# EAGLE design FinalEffect (EAGLE 7.7.0)

## Sheet 1 of 6: Pots & analog mux
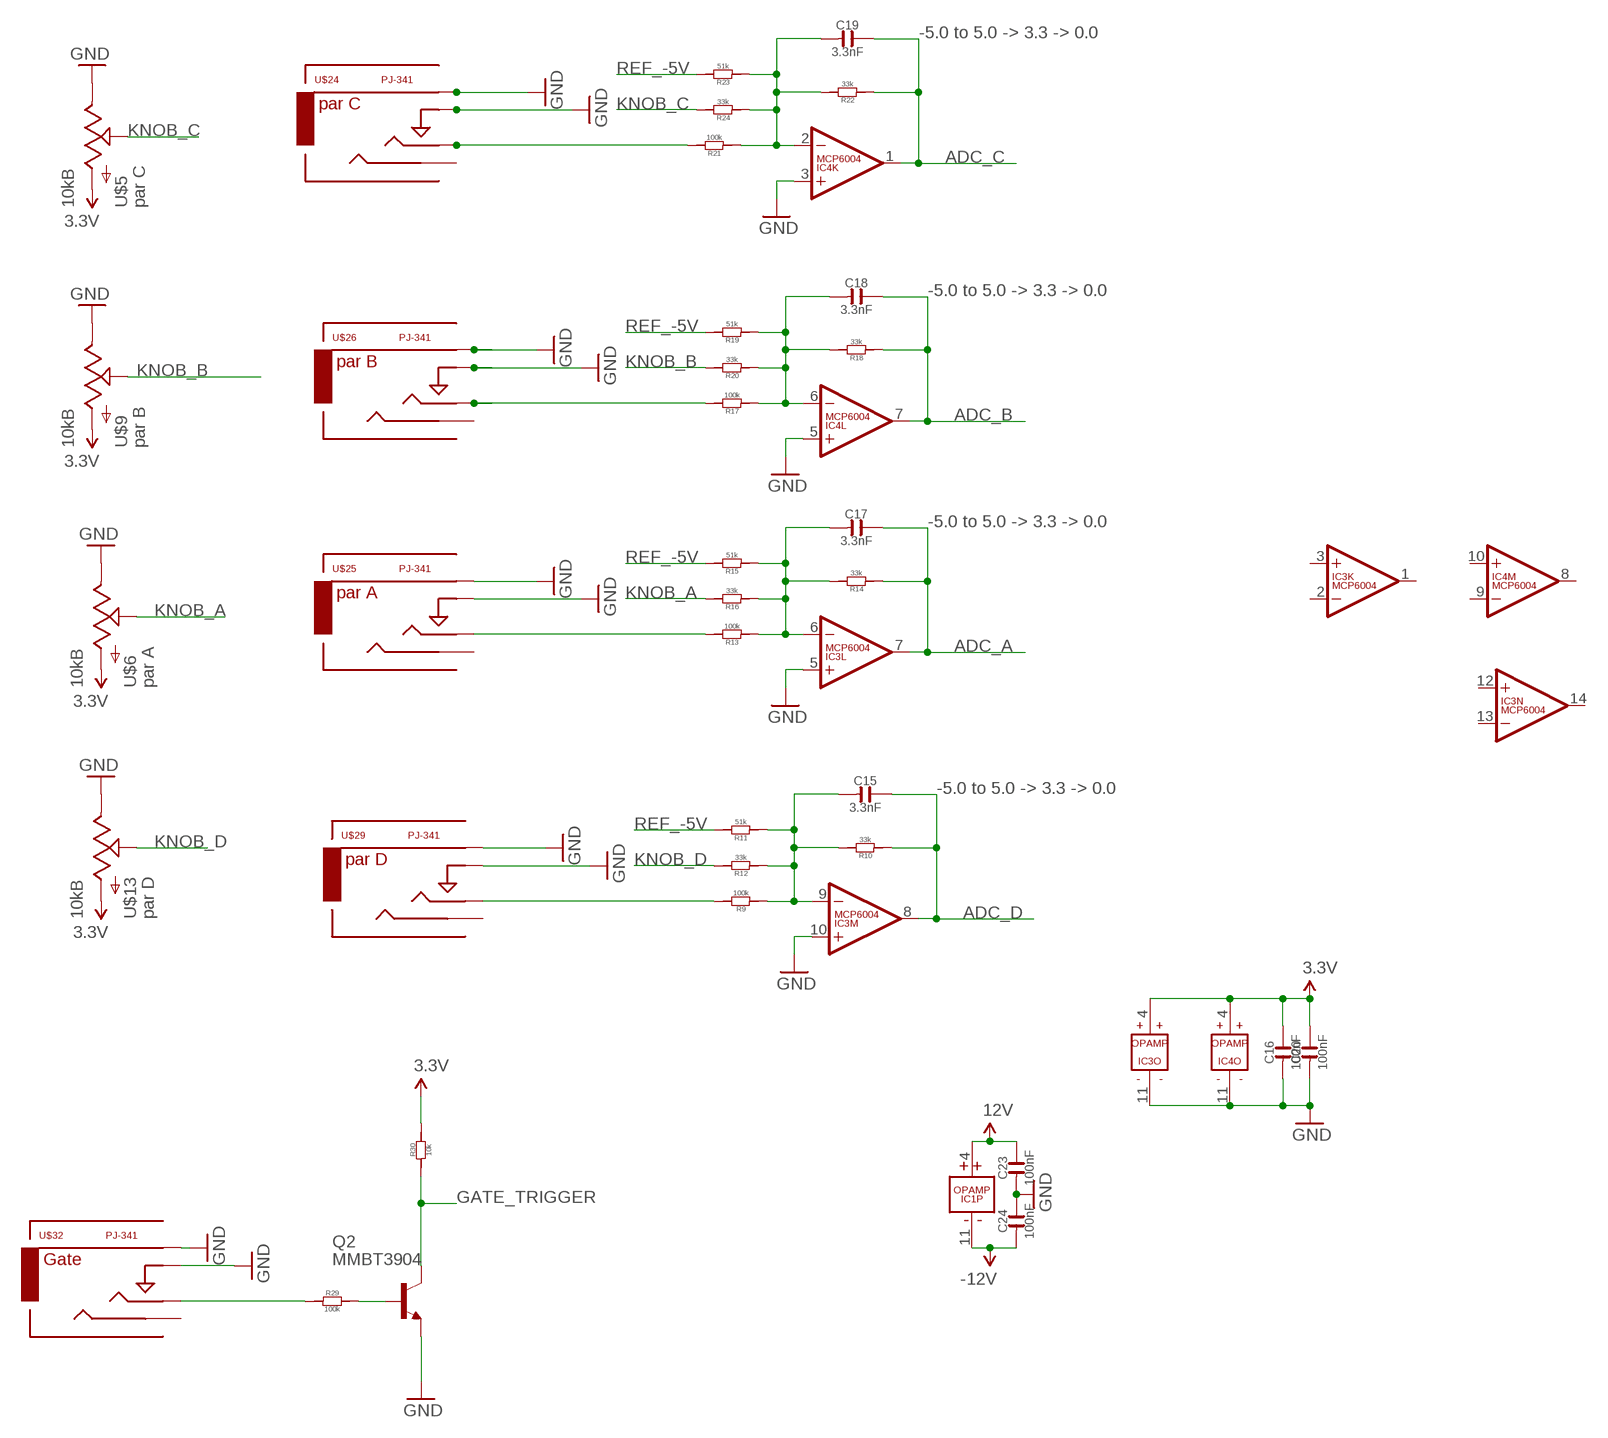
[diagram p0: schematic, sheet 1]

### Parts
C15  3.3nF  C-0603  [C0603]
C16  100nF  C-0603  [C0603]
C17  3.3nF  C-0603  [C0603]
C18  3.3nF  C-0603  [C0603]
C19  3.3nF  C-0603  [C0603]
C20  100nF  C-0603  [C0603]
C23  100nF  C-0603  [C0603]
C24  100nF  C-0603  [C0603]
IC1  TL074D  [SO14]
IC3  MCP6004  [SO14]
IC4  MCP6004  [SO14]
Q2  MMBT3904  MMBT3904LT1-NPN-SOT23-BEC  [SOT23-BEC]
R9  100k  R-0603  [R0603]
R10  33k  R-0603  [R0603]
R11  51k  R-0603  [R0603]
R12  33k  R-0603  [R0603]
R13  100k  R-0603  [R0603]
R14  33k  R-0603  [R0603]
R15  51k  R-0603  [R0603]
R16  33k  R-0603  [R0603]
R17  100k  R-0603  [R0603]
R18  33k  R-0603  [R0603]
R19  51k  R-0603  [R0603]
R20  33k  R-0603  [R0603]
R21  100k  R-0603  [R0603]
R22  33k  R-0603  [R0603]
R23  51k  R-0603  [R0603]
R24  33k  R-0603  [R0603]
R29  100k  R-0603  [R0603]
R30  10k  R-0603  [R0603]
U$5  10kB  POTZEPHPOT  [OG-POTS_ALPS_POT_VERTICAL]
U$6  10kB  POTZEPHPOT  [OG-POTS_ALPS_POT_VERTICAL]
U$9  10kB  POTZEPHPOT  [OG-POTS_ALPS_POT_VERTICAL]
U$13  10kB  POTZEPHPOT  [OG-POTS_ALPS_POT_VERTICAL]
U$24  PJ-341  AUDIO-JACKINPUT  [3.5MM-JACK-SWITCH-13MM-INPUT]
U$25  PJ-341  AUDIO-JACKINPUT  [3.5MM-JACK-SWITCH-13MM-INPUT]
U$26  PJ-341  AUDIO-JACKINPUT  [3.5MM-JACK-SWITCH-13MM-INPUT]
U$29  PJ-341  AUDIO-JACKINPUT  [3.5MM-JACK-SWITCH-13MM-INPUT]
U$32  PJ-341  AUDIO-JACKINPUT  [3.5MM-JACK-SWITCH-13MM-INPUT]

### Nets
3.3V [mediumpower]: C16.2 C20.2 IC3.4(O:V+) IC4.4(O:V+) R30.2 U$5.P$3(A) U$6.P$3(A) U$9.P$3(A) U$13.P$3(A) ; also sheet 2,3,5
12V [heavypower]: C23.2 IC1.4(P:V+) ; also sheet 3,5
-12V [heavypower]: C24.1 IC1.11(P:V-) ; also sheet 3,5
ADC_A: C17.2 IC3.7(L:OUT) R14.1 ; also sheet 2
ADC_B: C18.2 IC4.7(L:OUT) R18.1 ; also sheet 2
ADC_C: C19.2 IC4.1(K:OUT) R22.1 ; also sheet 2
ADC_D: C15.2 IC3.8(M:OUT) R10.1 ; also sheet 2
GATE_TRIGGER: Q2.C R30.1 ; also sheet 2
GND: C16.1 C20.1 C23.1 C24.2 IC3.5(L:+IN) IC3.10(M:+IN) IC3.11(O:V-) IC4.3(K:+IN) IC4.5(L:+IN) IC4.11(O:V-) Q2.E U$5.P$1(E) U$6.P$1(E) U$9.P$1(E) U$13.P$1(E) U$24.RING@3(RING) U$24.SWITCH@3(SWITCH) U$25.RING@3(RING) U$25.SWITCH@3(SWITCH) U$26.RING@3(RING) U$26.SWITCH@3(SWITCH) U$29.RING@3(RING) U$29.SWITCH@3(SWITCH) U$32.RING@3(RING) U$32.SWITCH@3(SWITCH) ; also sheet 2,3,5,6
KNOB_A: R16.2 U$6.P$2(S)
KNOB_B: R20.2 U$9.P$2(S)
KNOB_C: R24.2 U$5.P$2(S)
KNOB_D: R12.2 U$13.P$2(S)
N$3: R17.2 U$26.TIP@3(TIP)
N$4: C18.1 IC4.6(L:-IN) R17.1 R18.2 R19.1 R20.1
N$5: R21.2 U$24.TIP@3(TIP)
N$7: C19.1 IC4.2(K:-IN) R21.1 R22.2 R23.1 R24.1
N$11: Q2.B R29.2
N$15: R9.2 U$29.TIP@3(TIP)
N$16: C15.1 IC3.9(M:-IN) R9.1 R10.2 R11.1 R12.1
N$17: R13.2 U$25.TIP@3(TIP)
N$18: C17.1 IC3.6(L:-IN) R13.1 R14.2 R15.1 R16.1
N$19: R29.1 U$32.TIP@3(TIP)
REF_-5V: R11.2 R15.2 R19.2 R23.2 ; also sheet 3,5
Unconnected: IC3.1(K:OUT) IC3.2(K:-IN) IC3.3(K:+IN) IC3.12(N:+IN) IC3.13(N:-IN) IC3.14(N:OUT) IC4.8(M:OUT) IC4.9(M:-IN) IC4.10(M:+IN) U$24.SECOND@3(SECOND) U$25.SECOND@3(SECOND) U$26.SECOND@3(SECOND) U$29.SECOND@3(SECOND) U$32.SECOND@3(SECOND)

### Notes on the sheet
- -5.0 to 5.0 -> 3.3 -> 0.0
- -5.0 to 5.0 -> 3.3 -> 0.0
- -5.0 to 5.0 -> 3.3 -> 0.0
- -5.0 to 5.0 -> 3.3 -> 0.0

## Sheet 2 of 6: MCU
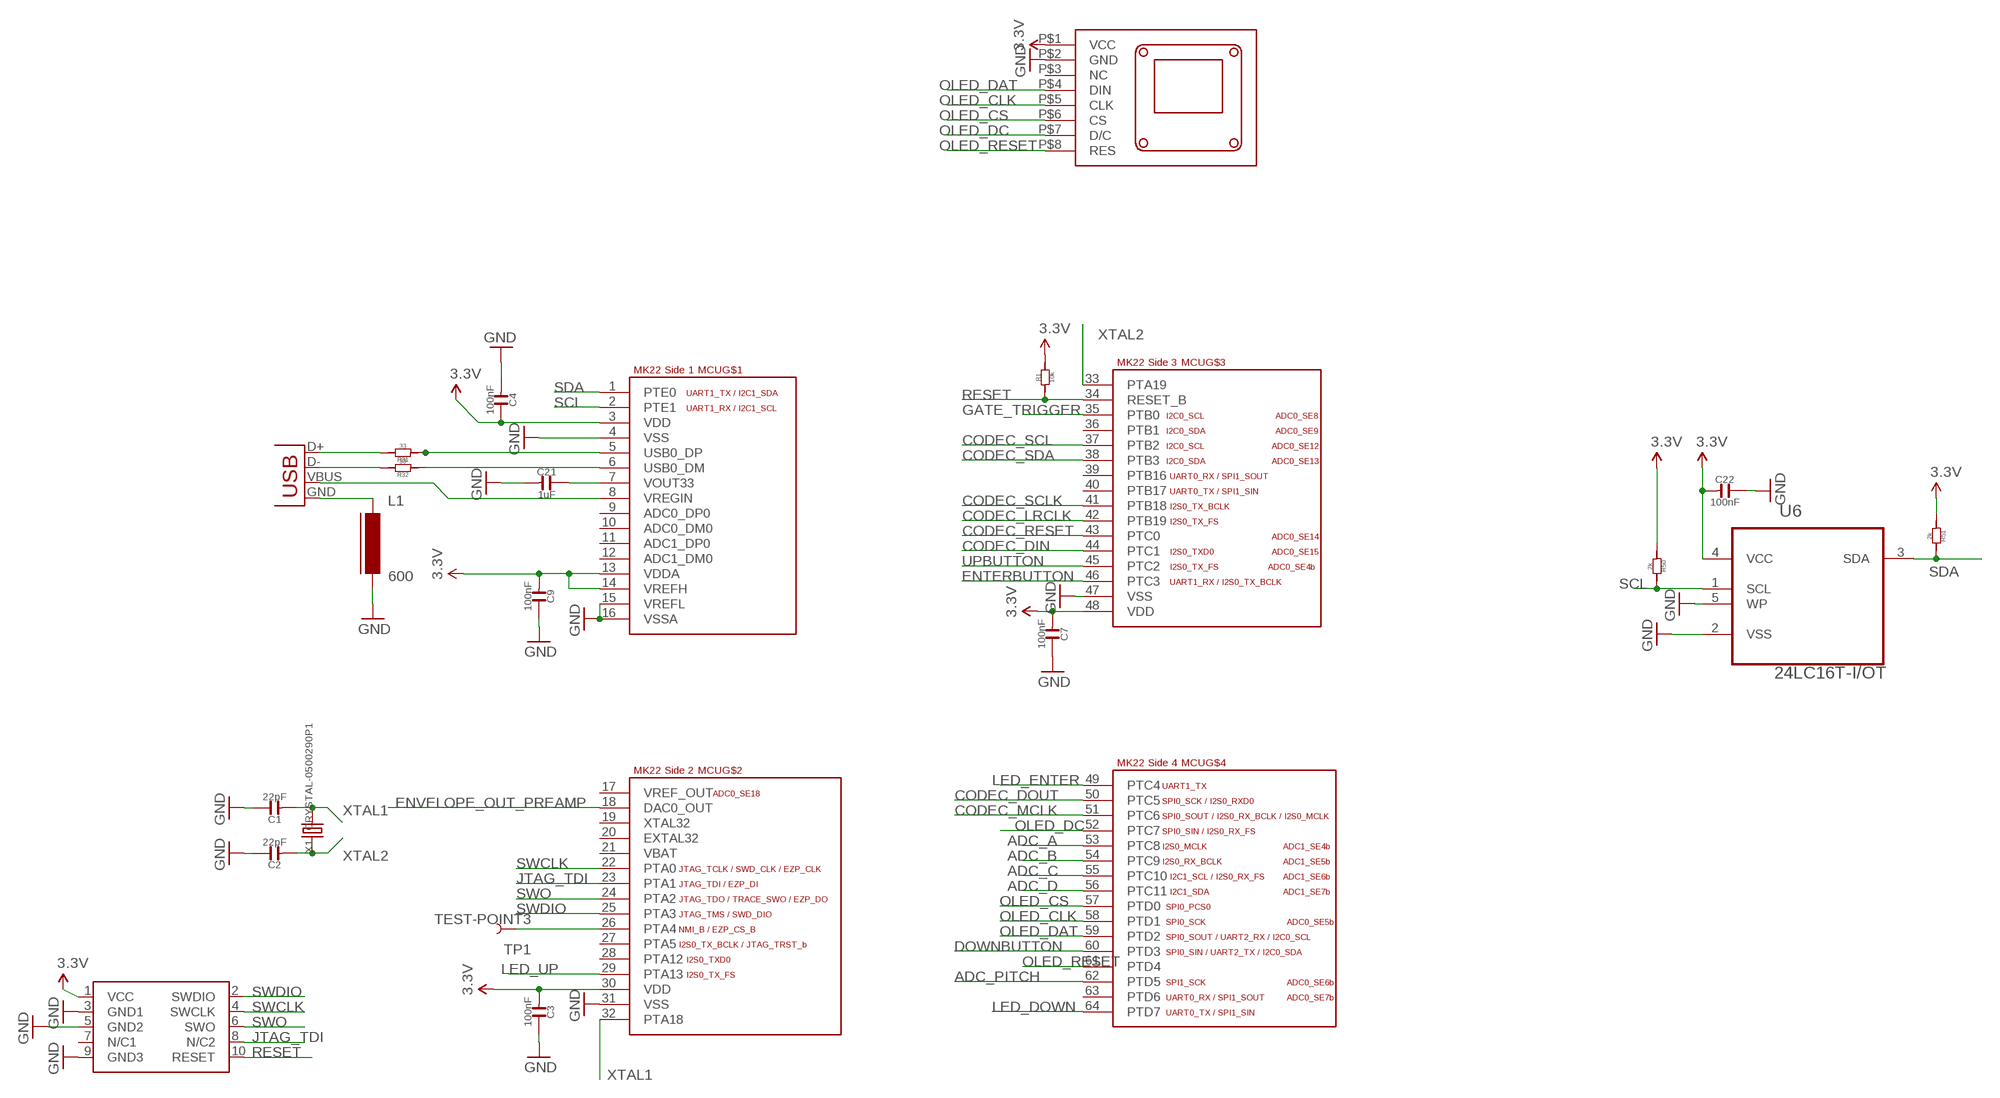
[diagram p1: schematic, sheet 2]

### Parts
C1  22pF  C-0603  [C0603]
C2  22pF  C-0603  [C0603]
C3  100nF  C-0603  [C0603]
C4  100nF  C-0603  [C0603]
C7  100nF  C-0603  [C0603]
C9  100nF  C-0603  [C0603]
C21  1uF  C-0603  [C0603]
C22  100nF  C-0603  [C0603]
JP1  USBPTH-VERTICAL  [USB-B-PTH-VERTICAL]
L1  600  FERRITE-0603  [FB603]
MCU  MK22_120_TQFP64  [MK22_TQFP64]
R1  10k  R-0603  [R0603]
R31  33  R-0603  [R0603]
R32  33  R-0603  [R0603]
R50  2k  R-0603  [R0603]
R51  2k  R-0603  [R0603]
SWD1  CORTEX_SWD  [M50-3600542]
TP1  TEST-POINT3  [PAD.03X.03]
U6  24LC16T-I/OT  24LC00T-I/OT  [SOT95P290X145-5N]
U$3  0.96OLEDMODULE  [1.3"OLEDMODULE]
X1  CRYSTAL-0500290P1  [2P-SMD-5.0X3.2]

### Nets
3.3V [mediumpower]: C3.1 C4.2 C7.1 C9.1 C22.1 MCU.3(VDD) MCU.13(VDDA) MCU.14(VREFH) MCU.30(VDD) MCU.48(VDD) R1.2 R50.1 R51.1 SWD1.1(VCC) U6.4(VCC) U$3.P$1(VCC) ; also sheet 1,3,5
ADC_A: MCU.53(PTC8) ; also sheet 1
ADC_B: MCU.54(PTC9) ; also sheet 1
ADC_C: MCU.55(PTC10) ; also sheet 1
ADC_D: MCU.56(PTC11) ; also sheet 1
ADC_PITCH: MCU.62(PTD5) ; also sheet 5
CODEC_DIN: MCU.44(PTC1) ; also sheet 5
CODEC_DOUT: MCU.50(PTC5) ; also sheet 5
CODEC_LRCLK: MCU.42(PTB19) ; also sheet 5
CODEC_MCLK: MCU.51(PTC6) ; also sheet 5
CODEC_RESET: MCU.43(PTC0) ; also sheet 5
CODEC_SCL: MCU.37(PTB2) ; also sheet 5
CODEC_SCLK: MCU.41(PTB18) ; also sheet 5
CODEC_SDA: MCU.38(PTB3) ; also sheet 5
DOWNBUTTON: MCU.60(PTD3) ; also sheet 6
ENTERBUTTON: MCU.46(PTC3) ; also sheet 6
ENVELOPE_OUT_PREAMP: MCU.18(DAC0_OUT) ; also sheet 5
GATE_TRIGGER: MCU.35(PTB0) ; also sheet 1
GND: C1.2 C2.2 C3.2 C4.1 C7.2 C9.2 C21.1 C22.2 L1.2 MCU.4(VSS) MCU.15(VREFL) MCU.16(VSSA) MCU.31(VSS) MCU.47(VSS) SWD1.3(GND1) SWD1.5(GND2) SWD1.9(GND3) U6.2(VSS) U6.5(WP) U$3.P$2(GND) ; also sheet 1,3,5,6
JTAG_TDI: MCU.23(PTA1) SWD1.8(N/C2)
LED_DOWN: MCU.64(PTD7) ; also sheet 6
LED_ENTER: MCU.49(PTC4) ; also sheet 6
LED_UP: MCU.29(PTA13) ; also sheet 6
N$20: C21.2 MCU.7(VOUT33)
N$21: JP1.D+ R31.2
N$22: JP1.D- R32.2
N$23 [mediumpower]: JP1.VBUS MCU.8(VREGIN)
N$24: MCU.5(USB0_DP) R31.1
N$25: MCU.6(USB0_DM) R32.1
N$26 [heavypower]: JP1.GND L1.1
N$57: MCU.26(PTA4) TP1.P$1
OLED_CLK: MCU.58(PTD1) U$3.P$5(CLK)
OLED_CS: MCU.57(PTD0) U$3.P$6(CS)
OLED_DAT: MCU.59(PTD2) U$3.P$4(DIN)
OLED_DC: MCU.52(PTC7) U$3.P$7(D/C)
OLED_RESET: MCU.61(PTD4) U$3.P$8(RES)
RESET: MCU.34(RESET_B) R1.1 SWD1.10(RESET)
SCL: MCU.2(PTE1) R50.2 U6.1(SCL)
SDA: MCU.1(PTE0) R51.2 U6.3(SDA)
SWCLK: MCU.22(PTA0) SWD1.4(SWCLK)
SWDIO: MCU.25(PTA3) SWD1.2(SWDIO)
SWO: MCU.24(PTA2) SWD1.6(SWO)
UPBUTTON: MCU.45(PTC2) ; also sheet 6
XTAL1: C1.1 MCU.32(PTA18) X1.2
XTAL2: C2.1 MCU.33(PTA19) X1.1
Unconnected: MCU.9(ADC0_DP0) MCU.10(ADC0_DM0) MCU.11(ADC1_DP0) MCU.12(ADC1_DM0) MCU.17(VREF_OUT) MCU.19(XTAL32) MCU.20(EXTAL32) MCU.21(VBAT) MCU.27(PTA5) MCU.28(PTA12) MCU.36(PTB1) MCU.39(PTB16) MCU.40(PTB17) MCU.63(PTD6) SWD1.7(N/C1) U$3.P$3(NC)

## Sheet 3 of 6: Power
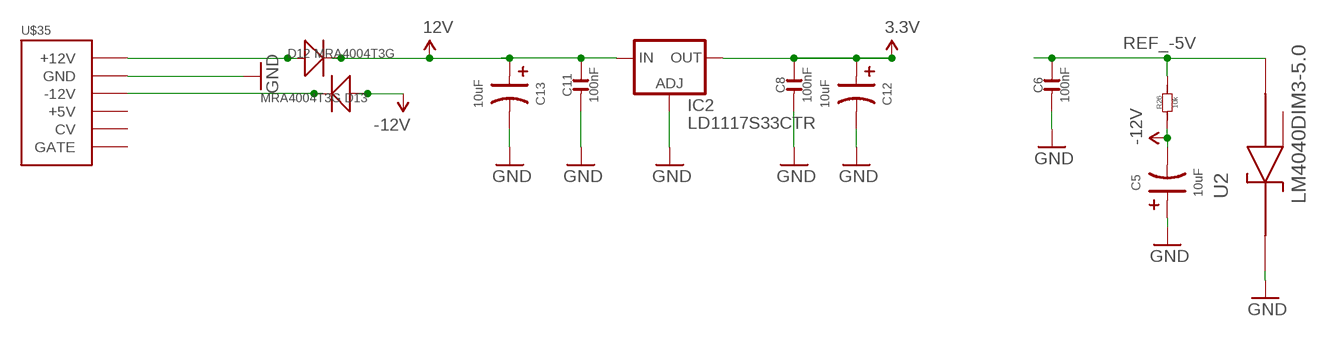
[diagram p2: schematic, sheet 3]

### Parts
C5  10uF  C-POLAR-A  [CASE-A_3216]
C6  100nF  C-0603  [C0603]
C8  100nF  C-0603  [C0603]
C11  100nF  C-0603  [C0603]
C12  10uF  C-POLAR-A  [CASE-A_3216]
C13  10uF  C-POLAR-A  [CASE-A_3216]
D12  MRA4004T3G  D-SMA  [DO-214AC]
D13  MRA4004T3G  D-SMA  [DO-214AC]
IC2  LD1117S33CTR  LD1117AS33TR  [SOT223]
R26  10k  R-0603  [R0603]
U2  LM4040DIM3-5.0  [SOT95P237X112-3N]
U$35  POWERSMT  [2X08_SMT_HEADER]

### Nets
3.3V [mediumpower]: C8.2 C12.+ IC2.2(OUT) IC2.4(OUT) ; also sheet 1,2,5
12V [heavypower]: C11.2 C13.+ D12.2(-) IC2.3(IN) ; also sheet 1,5
-12V [heavypower]: C5.- D13.1(+) R26.1 ; also sheet 1,5
GND: C5.+ C6.1 C8.1 C11.1 C12.- C13.- IC2.1(ADJ) U2.1(CATHODE) U$35.3(GND) U$35.4(GND) U$35.5(GND) U$35.6(GND) U$35.7(GND) U$35.8(GND) ; also sheet 1,2,5,6
N$13 [heavypower]: D12.1(+) U$35.9(+12V) U$35.10(+12V)
N$64 [heavypower]: D13.2(-) U$35.1(-12V) U$35.2(-12V)
REF_-5V: C6.2 R26.2 U2.2(ANODE) ; also sheet 1,5
Unconnected: U2.3(NC) U$35.11(+5V) U$35.12(+5V) U$35.13(CV) U$35.14(CV) U$35.15(GATE) U$35.16(GATE)

## Sheet 4 of 6: Cosmetic
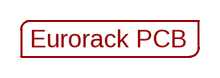
[diagram p3: schematic, sheet 4]

### Parts
U$1  EURORACK_PCB12HP  [EURORACK12HPPCB]

## Sheet 5 of 6: CODEC
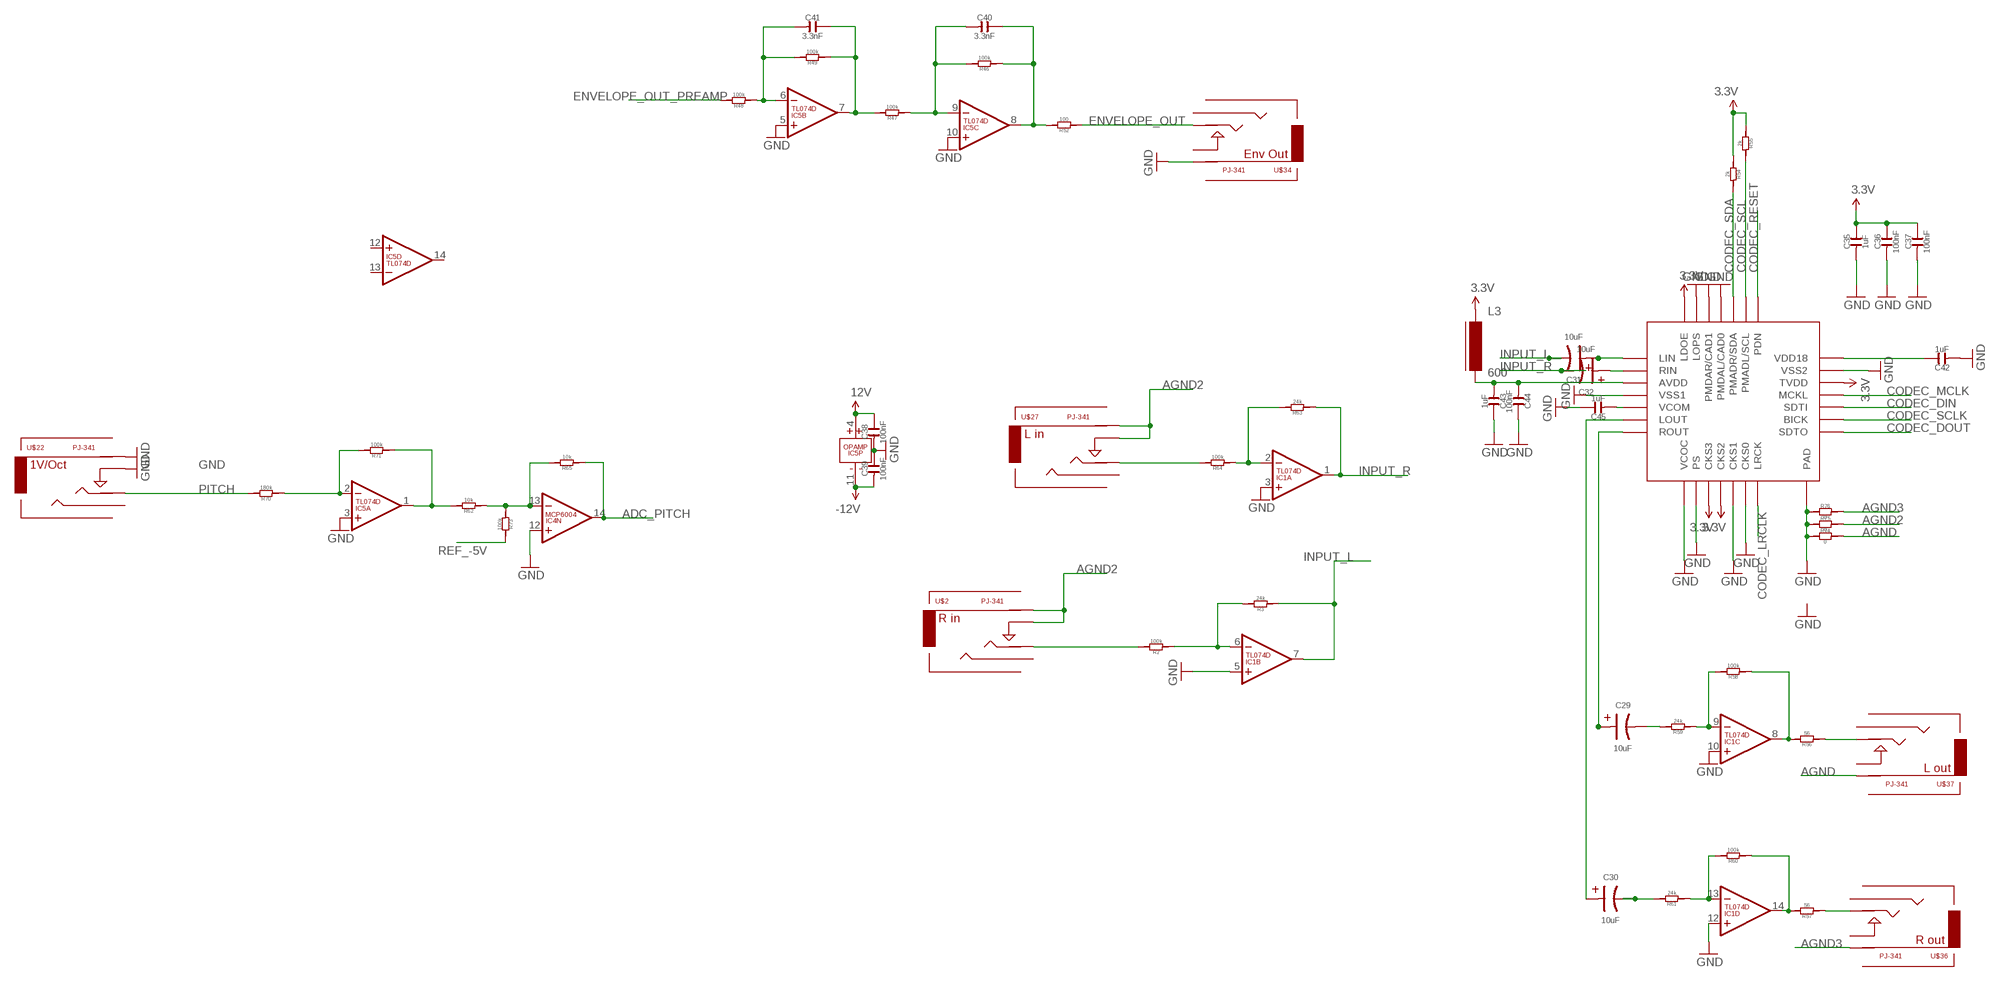
[diagram p4: schematic, sheet 5]

### Parts
C29  10uF  C-POLAR-A  [CASE-A_3216]
C30  10uF  C-POLAR-A  [CASE-A_3216]
C31  10uF  C-POLAR-A  [CASE-A_3216]
C32  10uF  C-POLAR-A  [CASE-A_3216]
C35  1uF  C-0603  [C0603]
C36  100nF  C-0603  [C0603]
C37  100nF  C-0603  [C0603]
C38  100nF  C-0603  [C0603]
C39  100nF  C-0603  [C0603]
C40  3.3nF  C-0603  [C0603]
C41  3.3nF  C-0603  [C0603]
C42  1uF  C-0603  [C0603]
C43  1uF  C-0603  [C0603]
C44  100nF  C-0603  [C0603]
C45  1uF  C-0603  [C0603]
IC5  TL074D  [SO14]
L3  600  FERRITE-0603  [FB603]
R2  100k  R-0603  [R0603]
R3  24k  R-0603  [R0603]
R46  100k  R-0603  [R0603]
R47  100k  R-0603  [R0603]
R48  100k  R-0603  [R0603]
R49  100k  R-0603  [R0603]
R52  100  R-0603  [R0603]
R54  2k  R-0603  [R0603]
R55  2k  R-0603  [R0603]
R56  56  R-0603  [R0603]
R57  56  R-0603  [R0603]
R58  100k  R-0603  [R0603]
R59  24k  R-0603  [R0603]
R60  100k  R-0603  [R0603]
R61  24k  R-0603  [R0603]
R62  10k  R-0603  [R0603]
R63  24k  R-0603  [R0603]
R64  100k  R-0603  [R0603]
R65  10k  R-0603  [R0603]
R70  180k  R-0603  [R0603]
R71  100k  R-0603  [R0603]
R73  100k  R-0603  [R0603]
R74  0  R-0603  [R0603]
R75  0  R-0603  [R0603]
R76  0  R-0603  [R0603]
U$2  PJ-341  AUDIO-JACKINPUT  [3.5MM-JACK-SWITCH-13MM-INPUT]
U$22  PJ-341  AUDIO-JACKINPUT  [3.5MM-JACK-SWITCH-13MM-INPUT]
U$27  PJ-341  AUDIO-JACKINPUT  [3.5MM-JACK-SWITCH-13MM-INPUT]
U$34  PJ-341  AUDIO-JACKOUTPUT  [3.5MM-JACK-SWITCH-13MM-OUTPUT]
U$36  PJ-341  AUDIO-JACKOUTPUT  [3.5MM-JACK-SWITCH-13MM-OUTPUT]
U$37  PJ-341  AUDIO-JACKOUTPUT  [3.5MM-JACK-SWITCH-13MM-OUTPUT]
U$48  AK4558  [QFN28]

### Nets
3.3V [mediumpower]: C35.2 C36.2 C37.2 L3.1 R54.2 R55.2 U$48.P$3(CKS3) U$48.P$4(CKS2) U$48.P$12(TVDD) U$48.P$21(LDOE) ; also sheet 1,2,3
3.3VAUDIO1: C43.1 C44.1 L3.2 U$48.P$24(AVDD)
12V [heavypower]: C38.2 IC5.4(P:V+) ; also sheet 1,3
-12V [heavypower]: C39.1 IC5.11(P:V-) ; also sheet 1,3
ADC_PITCH: IC4.14(N:OUT) R65.1 ; also sheet 2
AGND [heavypower]: R74.1 U$37.RING@3(RING)
AGND2 [heavypower]: R75.1 U$2.RING@3(RING) U$2.SWITCH@3(SWITCH) U$27.RING@3(RING) U$27.SWITCH@3(SWITCH)
AGND3 [heavypower]: R76.1 U$36.RING@3(RING)
CODEC_DIN: U$48.P$10(SDTI) ; also sheet 2
CODEC_DOUT: U$48.P$8(SDTO) ; also sheet 2
CODEC_LRCLK: U$48.P$7(LRCK) ; also sheet 2
CODEC_MCLK: U$48.P$11(MCKL) ; also sheet 2
CODEC_RESET: U$48.P$15(PDN) ; also sheet 2
CODEC_SCL: R55.1 U$48.P$16(PMADL/SCL) ; also sheet 2
CODEC_SCLK: U$48.P$9(BICK) ; also sheet 2
CODEC_SDA: R54.1 U$48.P$17(PMADR/SDA) ; also sheet 2
ENVELOPE_OUT: R52.1 U$34.TIP@3(TIP)
ENVELOPE_OUT_PREAMP: R48.2 ; also sheet 2
GND: C35.1 C36.1 C37.1 C38.1 C39.2 C42.1 C43.2 C44.2 C45.2 IC1.3(A:+IN) IC1.5(B:+IN) IC1.10(C:+IN) IC1.12(D:+IN) IC4.12(N:+IN) IC5.3(A:+IN) IC5.5(B:+IN) IC5.10(C:+IN) R74.2 R75.2 R76.2 U$22.RING@3(RING) U$22.SWITCH@3(SWITCH) U$34.RING@3(RING) U$48.P$1(VCOC) U$48.P$2(PS) U$48.P$5(CKS1) U$48.P$6(CKS0) U$48.P$13(VSS2) U$48.P$18(PMDAL/CAD0) U$48.P$19(PMDAR/CAD1) U$48.P$20(LOPS) U$48.P$25(VSS1) U$48.PAD ; also sheet 1,2,3,6
INPUT_L: C31.- IC1.7(B:OUT) R3.1
INPUT_R: C32.- IC1.1(A:OUT) R63.1
LEFT_AFTER_CAP: C29.- R59.2
LEFT_BEFORE_CAP: C29.+ U$48.P$28(ROUT)
LEFT_POST_OPAMP: IC1.8(C:OUT) R56.2 R58.1
LEFT_PRE_OPAMP: IC1.9(C:-IN) R58.2 R59.1
LEFT_TO_JACK: R56.1 U$37.TIP@3(TIP)
N$1: R2.2 U$2.TIP@3(TIP)
N$2: IC1.6(B:-IN) R2.1 R3.2
N$47: C40.2 IC5.8(C:OUT) R46.1 R52.2
N$52: C32.+ U$48.P$23(RIN)
N$54: C41.1 IC5.6(B:-IN) R48.1 R49.2
N$55: C41.2 IC5.7(B:OUT) R47.2 R49.1
N$56: C40.1 IC5.9(C:-IN) R46.2 R47.1
N$61: C30.+ U$48.P$27(LOUT)
N$63: C31.+ U$48.P$22(LIN)
N$70: R64.2 U$27.TIP@3(TIP)
N$71: IC5.2(A:-IN) R70.1 R71.2
N$72: IC5.1(A:OUT) R62.2 R71.1
N$73: C30.- R61.2
N$75: IC1.14(D:OUT) R57.2 R60.1
N$76: IC1.13(D:-IN) R60.2 R61.1
N$78: R57.1 U$36.TIP@3(TIP)
N$83: IC1.2(A:-IN) R63.2 R64.1
N$84: IC4.13(N:-IN) R62.1 R65.2 R73.1
N$87: C42.2 U$48.P$14(VDD18)
N$88: C45.1 U$48.P$26(VCOM)
PITCH: R70.2 U$22.TIP@3(TIP)
REF_-5V: R73.2 ; also sheet 1,3
Unconnected: IC5.12(D:+IN) IC5.13(D:-IN) IC5.14(D:OUT) U$2.SECOND@3(SECOND) U$22.SECOND@3(SECOND) U$27.SECOND@3(SECOND) U$34.SECOND@3(SECOND) U$34.SWITCH@3(SWITCH) U$36.SECOND@3(SECOND) U$36.SWITCH@3(SWITCH) U$37.SECOND@3(SECOND) U$37.SWITCH@3(SWITCH)

## Sheet 6 of 6: LEDs and buttons
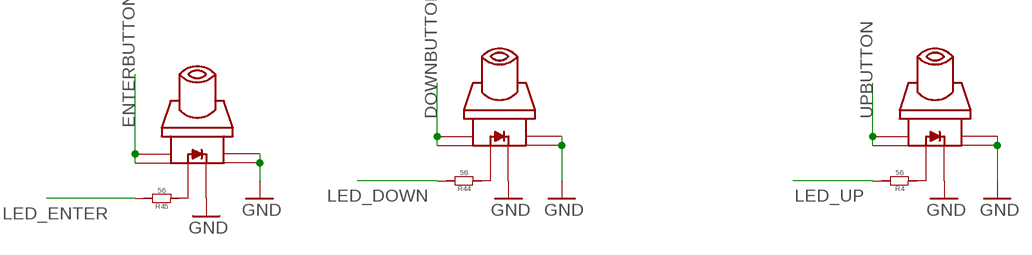
[diagram p5: schematic, sheet 6]

### Parts
R4  56  R-0603  [R0603]
R44  56  R-0603  [R0603]
R45  56  R-0603  [R0603]
U$4  SWITCH_W_LED_PB6149L-X-102YELLOW  [PB6149L]
U$38  SWITCH_W_LED_PB6149L-X-102YELLOW  [PB6149L]
U$39  SWITCH_W_LED_PB6149L-X-102YELLOW  [PB6149L]

### Nets
DOWNBUTTON: U$38.1 U$38.2 ; also sheet 2
ENTERBUTTON: U$39.1 U$39.2 ; also sheet 2
GND: U$4.3 U$4.4 U$4.LEDNEG(NEG) U$38.3 U$38.4 U$38.LEDNEG(NEG) U$39.3 U$39.4 U$39.LEDNEG(NEG) ; also sheet 1,2,3,5
LED_DOWN: R44.2 ; also sheet 2
LED_ENTER: R45.2 ; also sheet 2
LED_UP: R4.2 ; also sheet 2
N$6: R4.1 U$4.LEDPOS(POS)
N$38: R44.1 U$38.LEDPOS(POS)
N$39: R45.1 U$39.LEDPOS(POS)
UPBUTTON: U$4.1 U$4.2 ; also sheet 2

## Library data of the parts
C1-C4 C7 C9 C21 C22 = OPL:C*
C5 C12 C13 C29-C32 = EurorackModularParts:C-POLAR*; MF: AVX; MPN: TAJB106K020RNJ; OC_FARNELL: 197427
C6 = OPL:C*; MF: AVX; MPN: 06035C104KAT2A; OC_FARNELL: 1301804
C8 C11 = OPL:C*; MF: MULTICOMP; MPN: MC0603F104Z160CT; OC_FARNELL: 1759017
C15-C20 C23 C24 C35-C45 = OPL:C*; OC_FARNELL: unknown
D12 D13 = OPL:D*: DIODE; MF: VISHAY; MPN: US1G-E3/5AT; OC_FARNELL: 9551824
IC1 IC5 = EurorackModularParts:TL074: OP AMP
IC2 = ld-components:LD1117A?*: Low drop fixed and adjustable positive voltage regulators 1 A Source: http://www.st.com/stonline/products/literature/ds/7194/ld1117axx.pdf; MF: STMICROELECTRONICS; MPN: LD1117AS33TR; OC_FARNELL: 1467776
IC3 IC4 = EurorackModularParts:MCP6004; MF: MICROCHIP; MPN: MCP6004-I/SL.; OC_FARNELL: 1605572
JP1 = SparkFun-Connectors:USB: USB Connectors USB-B-PTH is fully proven SKU : PRT-00139/CONN-08278 USB-miniB is fully proven SKU : PRT-00587 USB-A-PCB is untested. USB-A-H is throughly reviewed, but untested. Spark Fun Electronics SKU : PRT-00437 USB-B-SMT is throughly reviewed, but untested. Needs silkscreen touching up. USB-A-S has not been used/tested USB-MB-H has not been used/tested USB-MICROB has been used. CONN-09505
L1 L3 = dp_devices:FERRITE: Ferrite bead in various packages
MCU = EurorackModularParts:MK22_120_TQFP64
Q2 = transistor:*-NPN-: NPN Transistror BF959 corrected 2008.03.06; MF: NXP; MPN: PMBT3904,215; OC_FARNELL: 2336795
R1 R31 R32 = OPL:R*
R2-R4 R9-R24 R26 R29 R30 R44-R52 R54-R65 R70 R71 R73-R76 = OPL:R*; OC_FARNELL: unknown
SWD1 = carrilib with jtags:CORTEX_SWD: .05" Cortex M Connector in SWD mode Manufacturer: Generic Part Number: Cortex M SWD Notes: I use Harwin M50-3600542 connectors
TP1 = SparkFun-Passives:TEST-POINT: Bare copper test points for troubleshooting or ICT
U2 = FarnellThings:LM4040DIM3-5.0: IC, Precision Micropower Shunt Voltage Reference, 5V,SOT-23-3; MF: TEXAS INSTRUMENTS; MPN: LM4040DIM3-5.0; OC_FARNELL: 9778330; OC_NEWARK: 97K3489; PACKAGE: SOT-23-3; SUPPLIER: TEXAS INSTRUMENTS
U6 = EurorackModularParts:24LC00T-I/OT: IC, EEPROM 128BIT SERIAL 400KHZ SOT-23-5; MF: MICROCHIP; MPN: 24LC00T-I/OT; OC_FARNELL: 9757864; OC_NEWARK: 62K0574; PACKAGE: SOT-23-5; SUPPLIER: MICROCHIP
U$1 = EurorackModularParts:EURORACK_PCB
U$2 = EurorackModularParts:AUDIO-JACK: Switching Mono 3.5mm Audio Jack from Erthenvar.; DESC: R in; MPN: PJ-341
U$3 = zephod-tft:0.96OLEDMODULE
U$4 U$38 U$39 = zephod-components:SWITCH_W_LED_PB6149L-X-102
U$5 = EurorackModularParts:POT; DESC: par C
U$6 = EurorackModularParts:POT; DESC: par A
U$9 = EurorackModularParts:POT; DESC: par B
U$13 = EurorackModularParts:POT; DESC: par D
U$22 = EurorackModularParts:AUDIO-JACK: Switching Mono 3.5mm Audio Jack from Erthenvar.; DESC: 1V/Oct; MPN: PJ-341
U$24 = EurorackModularParts:AUDIO-JACK: Switching Mono 3.5mm Audio Jack from Erthenvar.; DESC: par C; MPN: PJ-341
U$25 = EurorackModularParts:AUDIO-JACK: Switching Mono 3.5mm Audio Jack from Erthenvar.; DESC: par A; MPN: PJ-341
U$26 = EurorackModularParts:AUDIO-JACK: Switching Mono 3.5mm Audio Jack from Erthenvar.; DESC: par B; MPN: PJ-341
U$27 = EurorackModularParts:AUDIO-JACK: Switching Mono 3.5mm Audio Jack from Erthenvar.; DESC: L in; MPN: PJ-341
U$29 = EurorackModularParts:AUDIO-JACK: Switching Mono 3.5mm Audio Jack from Erthenvar.; DESC: par D; MPN: PJ-341
U$32 = EurorackModularParts:AUDIO-JACK: Switching Mono 3.5mm Audio Jack from Erthenvar.; DESC: Gate; MPN: PJ-341
U$34 = EurorackModularParts:AUDIO-JACK: Switching Mono 3.5mm Audio Jack from Erthenvar.; DESC: Env Out; MPN: PJ-341
U$35 = EurorackModularParts:POWER
U$36 = EurorackModularParts:AUDIO-JACK: Switching Mono 3.5mm Audio Jack from Erthenvar.; DESC: R out; MPN: PJ-341
U$37 = EurorackModularParts:AUDIO-JACK: Switching Mono 3.5mm Audio Jack from Erthenvar.; DESC: L out; MPN: PJ-341
U$48 = EurorackModularParts:AK4558
X1 = OPL:CRYSTAL*

## Net classes
0 default: width 0.203 mm
1 heavypower: width 0.381 mm
2 mediumpower: width 0.254 mm
3 groundplane: width 0.254 mm, clearance 0.203 mm

## Board
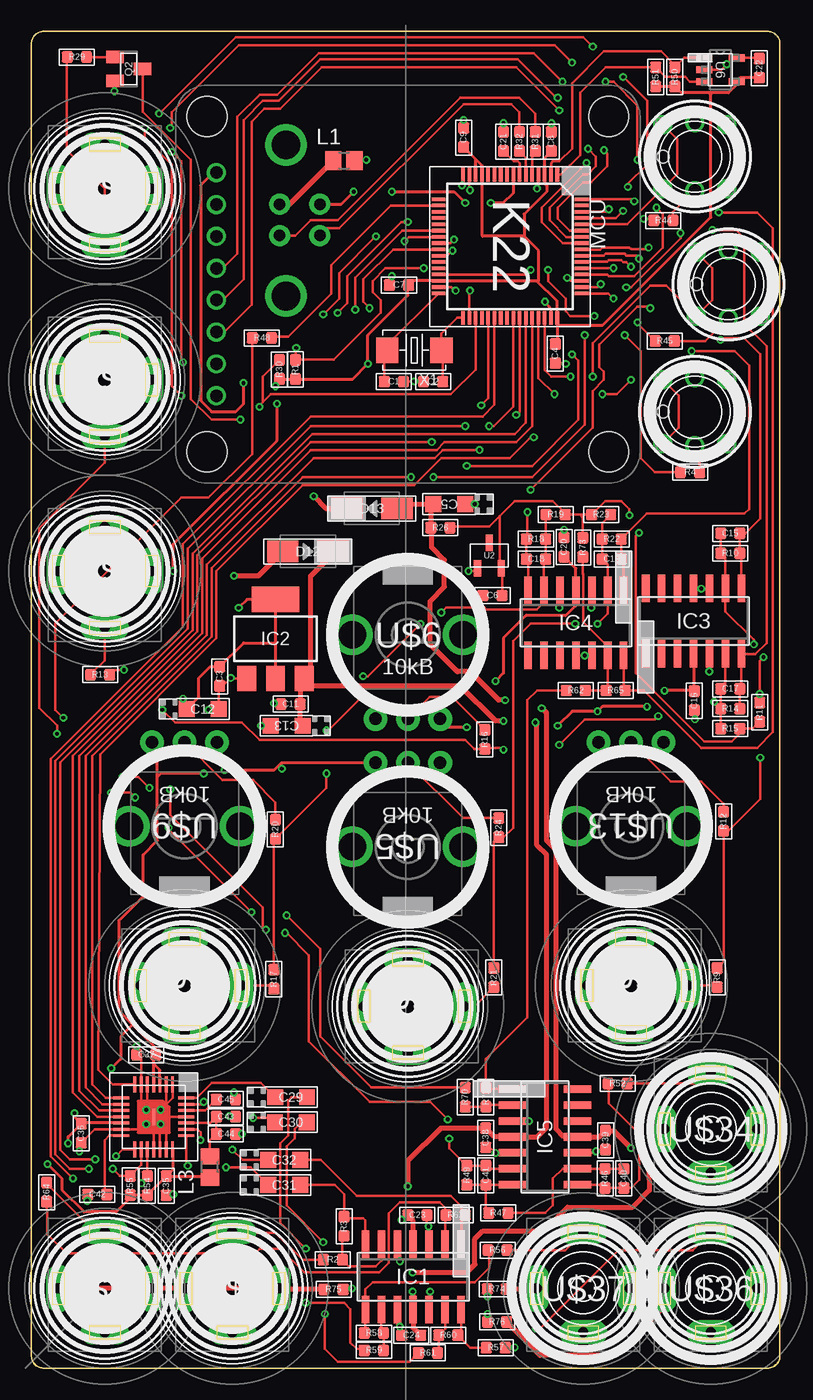
[diagram p6: board, top side]
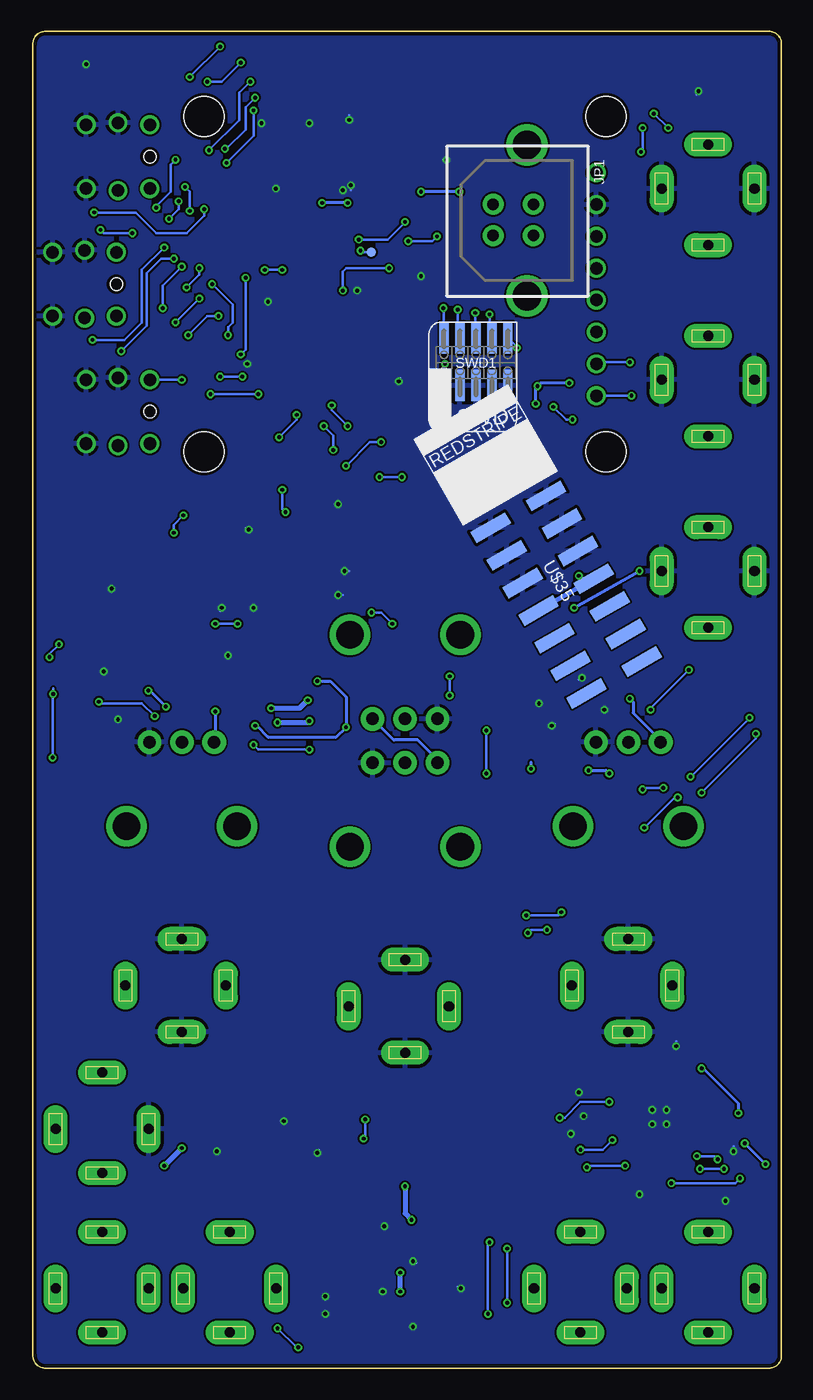
[diagram p7: board, bottom side, seen from below]

Size 59.62 x 106.5 mm. Coordinates in mm from the lower left corner, seen from the top.
Copper layers (1*16): Top 0.035mm / dielectric 1.5mm / Bottom 0.035mm
Design rules "ITEADstudio_DRC": minimum track width 6mil, minimum drill 12mil, track to track 6mil, track to pad 6mil, pad to pad 6mil, via to via 6mil, smd to smd 0mil, copper to edge 10mil, drill to drill 10mil, minimum pad ring 10mil, minimum via ring 6mil, stop-mask expansion 2mil, vias tented up to drill 100mil, thermal gap 10mil

### Footprints (pad centres in the part's own frame; a part is rotated, then mirrored left to right if it is on the bottom)
C0603 = smd 0.889 x 0.889: 1 -0.762,0; 2 0.762,0
CASE-A_3216 = smd 1.27 x 1.27: + -1.27,0; - 1.27,0
DO-214AC = smd 2.5 x 1.7: 1 -2,0; 2 2,0
SO14 = smd 0.6 x 2.2: 1 -3.81,-2.6; 2 -2.54,-2.6; 3 -1.27,-2.6; 4 0,-2.6; 5 1.27,-2.6; 6 2.54,-2.6; 7 3.81,-2.6; 8 3.81,2.6; 9 2.54,2.6; 10 1.27,2.6; 11 0,2.6; 12 -1.27,2.6; 13 -2.54,2.6; 14 -3.81,2.6
SOT223 = smd 1.5 x 2: 1 -2.3,-3.15; 2 0,-3.15; 3 2.3,-3.15 | smd 3.8 x 2: 4 0,3.15
USB-B-PTH-VERTICAL = drill 0.914 pad 1.676: D+ 4.826,4.394; D- 4.826,7.595; GND 7.315,4.394; VBUS 7.315,7.595 | drill 2.286: P$1 0,4.902; P$2 12.04,4.902
FB603 = smd 1.3 x 1.5: 1 -0.85,0; 2 0.85,0
MK22_TQFP64 = smd 1.1 x 0.285: 1 -5.605,3.385; 2 -5.605,2.885; 3 -5.605,2.385; 4 -5.605,1.885; 5 -5.605,1.385; 6 -5.605,0.885; 7 -5.605,0.385; 8 -5.605,-0.115; 9 -5.605,-0.615; 10 -5.605,-1.115; 11 -5.605,-1.615; 12 -5.605,-2.115; 13 -5.605,-2.615; 14 -5.605,-3.115; 15 -5.605,-3.615; 16 -5.605,-4.115; 33 5.795,-4.115; 34 5.795,-3.615; 35 5.795,-3.115; 36 5.795,-2.615; 37 5.795,-2.115; 38 5.795,-1.615; 39 5.795,-1.115; 40 5.795,-0.615; 41 5.795,-0.115; 42 5.795,0.385; 43 5.795,0.885; 44 5.795,1.385; 45 5.795,1.885; 46 5.795,2.385; 47 5.795,2.885; 48 5.795,3.385 | smd 0.285 x 1.1: 17 -3.655,-6.065; 18 -3.155,-6.065; 19 -2.655,-6.065; 20 -2.155,-6.065; 21 -1.655,-6.065; 22 -1.155,-6.065; 23 -0.655,-6.065; 24 -0.155,-6.065; 25 0.345,-6.065; 26 0.845,-6.065; 27 1.345,-6.065; 28 1.845,-6.065; 29 2.345,-6.065; 30 2.845,-6.065; 31 3.345,-6.065; 32 3.845,-6.065; 49 3.845,5.335; 50 3.345,5.335; 51 2.845,5.335; 52 2.345,5.335; 53 1.845,5.335; 54 1.345,5.335; 55 0.845,5.335; 56 0.345,5.335; 57 -0.155,5.335; 58 -0.655,5.335; 59 -1.155,5.335; 60 -1.655,5.335; 61 -2.155,5.335; 62 -2.655,5.335; 63 -3.155,5.335; 64 -3.655,5.335
SOT23-BEC = smd 1 x 1.4: B -0.95,-1.1; C 0,1.1; E 0.95,-1.1
R0603 = smd 0.889 x 0.889: 1 -0.762,0; 2 0.762,0
M50-3600542 = smd 0.75 x 2.5: 1 -2.54,-1.81; 2 -2.54,2; 3 -1.27,-1.81; 4 -1.27,2; 5 0,-1.81; 6 0,2; 7 1.27,-1.81; 8 1.27,2; 9 2.54,-1.81; 10 2.54,2
PAD.03X.03 = smd 0.762 x 0.762: P$1 0,0
SOT95P237X112-3N = smd 1.321 x 0.559: 1 -1.016,0.94; 2 -1.016,-0.94; 3 1.016,0
SOT95P290X145-5N = smd 1.27 x 0.559: 1 -1.295,0.94; 2 -1.295,0; 3 -1.295,-0.94; 4 1.295,-0.94; 5 1.295,0.94
3.5MM-JACK-SWITCH-13MM-INPUT = drill 0.8 pad 1.93 long: RING@3 -3.7,0; SECOND@3 0,-3.5; SWITCH@3 3.7,0; TIP@3 0,4.5
1.3"OLEDMODULE = drill 1: P$1 8.89,15.24; P$2 6.35,15.24; P$3 3.81,15.24; P$4 1.27,15.24; P$5 -1.27,15.24; P$6 -3.81,15.24; P$7 -6.35,15.24; P$8 -8.89,15.24 | hole 3.2: -13.35,16; 13.35,16; 13.35,-16; -13.35,-16
PB6149L = drill 1: 1 2.54,2.54; 2 2.54,-2.54; 3 -2.54,2.54; 4 -2.54,-2.54; LEDNEG 0,-2.7; LEDPOS 0,2.7 | hole 1: 2.54,0
OG-POTS_ALPS_POT_VERTICAL = drill 1 pad 1.88: P$1 -2.58,-6.7; P$2 0,-6.7; P$3 2.58,-6.7 | drill 2.2 pad 3.175: P$4 4.4,0; P$5 -4.4,0
3.5MM-JACK-SWITCH-13MM-OUTPUT = drill 0.8 pad 1.93 long: RING@3 -3.7,0; SECOND@3 0,-3.5; SWITCH@3 3.7,0; TIP@3 0,4.5
2X08_SMT_HEADER = smd 1 x 3.17: 1 -8.89,-2.54; 2 -8.89,2.54; 3 -6.35,-2.54; 4 -6.35,2.54; 5 -3.81,-2.54; 6 -3.81,2.54; 7 -1.27,-2.54; 8 -1.27,2.54; 9 1.27,-2.54; 10 1.27,2.54; 11 3.81,-2.54; 12 3.81,2.54; 13 6.35,-2.54; 14 6.35,2.54; 15 8.89,-2.54; 16 8.89,2.54
QFN28 = smd 1.27 x 0.23: P$1 -2.585,1.5; P$2 -2.585,1; P$3 -2.585,0.5; P$4 -2.585,0; P$5 -2.585,-0.5; P$6 -2.585,-1; P$7 -2.585,-1.5; P$15 2.585,-1.5; P$16 2.585,-1; P$17 2.585,-0.5; P$18 2.585,0; P$19 2.585,0.5; P$20 2.585,1; P$21 2.585,1.5; PAD 0,0 | smd 0.23 x 1.27: P$8 -1.5,-2.585; P$9 -1,-2.585; P$10 -0.5,-2.585; P$11 0,-2.585; P$12 0.5,-2.585; P$13 1,-2.585; P$14 1.5,-2.585; P$22 1.5,2.585; P$23 1,2.585; P$24 0.5,2.585; P$25 0,2.585; P$26 -0.5,2.585; P$27 -1,2.585; P$28 -1.5,2.585
2P-SMD-5.0X3.2 = smd 1.778 x 2.032: 1 -2.159,0; 2 2.159,0

### Placement (x,y rotation side)
C1  28.87,78.59 0 top
C2  31.99,78.59 180 top
C3  14.99,55.12 270 top
C4  41.73,80.83 90 top
C5  33.28,68.83 180 top
C6  36.72,61.56 0 top
C7  29.28,86.3 180 top
C8  41.41,97.73 270 top
C9  34.42,98.04 90 top
C11  20.65,52.9 0 top
C12  13.66,52.51 0 top
C13  20.33,51.18 180 top
C15  55.66,66.51 0 top
C16  52.8,53.17 90 top
C17  55.66,54.12 0 top
C18  40.19,64.46 180 top
C19  46.22,64.46 0 top
C20  42.42,65.41 270 top
C21  37.6,97.73 270 top
C22  57.98,103.57 90 top
C23  30.74,12.19 180 top
C24  30.24,2.62 180 top
C29  20.68,21.59 0 top
C30  20.67,19.59 0 top
C31  20.14,14.59 0 top
C32  20.14,16.59 0 top
C35  10.74,14.53 90 top
C36  3.97,18.71 90 top
C37  9.14,24.97 0 top
C38  36.19,18.35 90 top
C39  45.73,18.16 270 top
C40  47.19,15.11 270 top
C41  36.2,15.37 270 top
C42  5.25,13.84 0 top
C43  15.49,20.03 0 top
C44  15.49,18.65 0 top
C45  15.49,21.4 0 top
D12  22.02,65.07 0 top
D13  27.11,68.5 180 top
IC1  30.41,7.28 180 top
IC2  19.44,58.1 0 top
IC3  52.74,59.52 0 top
IC4  43.36,59.38 180 top
IC5  40.9,18.43 270 top
JP1  15.38,85.41 90 bottom
L1  24.89,96.2 0 top
L3  14.22,16.03 90 top
MCU  38.49,89.47 270 top
Q2  7.76,103.5 270 top
R1  21.04,79.57 270 top
R2  24.01,8.64 180 top
R3  24.9,11.3 270 top
R4  52.46,71.37 180 top
R9  54.62,31.11 270 top
R10  55.66,64.92 180 top
R11  58.01,52.26 270 top
R12  55.13,43.56 90 top
R13  5.47,55.24 180 top
R14  55.66,52.54 180 top
R15  55.66,50.95 0 top
R16  36.11,50.09 90 top
R17  19.31,30.99 270 top
R18  40.19,66.05 0 top
R19  41.75,68.01 0 top
R20  19.44,42.93 90 top
R21  36.84,31.11 270 top
R22  46.22,66.05 180 top
R23  45.38,68.01 180 top
R24  37.22,43.05 90 top
R26  32.58,66.95 0 top
R29  3.63,104.46 0 top
R30  19.76,79.57 270 top
R31  40.14,97.73 90 top
R32  38.87,97.73 90 top
R44  50.33,91.43 180 top
R45  50.45,81.83 180 top
R46  45.69,15.11 90 top
R47  37.19,12.36 180 top
R48  18.36,82.08 0 top
R49  34.68,15.37 90 top
R50  51.25,102.87 90 top
R51  49.73,102.87 90 top
R52  46.68,22.67 180 top
R54  9.24,14.53 270 top
R55  7.87,14.54 270 top
R56  37.13,9.4 180 top
R57  36.99,1.64 180 top
R58  27.29,2.79 0 top
R59  27.29,1.42 180 top
R60  33.2,2.63 180 top
R61  31.58,1.21 180 top
R62  43.36,53.98 180 top
R63  33.79,12.19 180 top
R64  1.21,14.02 90 top
R65  46.54,53.98 180 top
R70  34.55,21.59 90 top
R71  36.2,21.59 270 top
R73  43.92,65.39 90 top
R74  37.06,6.3 180 top
R75  24.07,6.27 0 top
R76  37.09,3.68 180 top
SWD1  24.34,80.09 0 bottom
TP1  32.69,88.9 90 bottom
U2  36.47,64.73 90 top
U6  54.87,103.44 0 top
U$1  -0.5,0 0 top
U$2  16.01,6.35 0 top
U$3  29.98,86.36 90 top
U$4  52.84,76.2 180 top
U$5  29.98,41.53 180 top
U$6  29.98,58.42 0 top
U$9  12.2,43.18 180 top
U$13  47.76,43.18 180 top
U$22  5.85,78.74 180 top
U$24  29.98,28.83 270 top
U$25  5.85,63.5 180 top
U$26  12.2,30.48 270 top
U$27  5.85,6.35 0 top
U$29  47.76,30.48 270 top
U$32  5.85,93.98 180 top
U$34  54.11,19.05 0 top
U$35  17.78,62.72 300 bottom
U$36  54.11,6.35 0 top
U$37  43.95,6.35 0 top
U$38  52.84,96.52 180 top
U$39  55.51,86.36 180 top
U$48  9.74,20.03 270 top
X1  30.5,81.09 180 top

### Tracks (layer width: path | path; a pad name or v marks a point on that pad's centre or on a via)
3.3V  (via drill 0.3)
  Top 0.254: C35.2 14.11,15.29 L3.1 | U$48.P$21 11.24,15.79 C35.2 | C35.2 9.24,13.79 R54.2 7.89,13.76 R55.2 7.87,13.58 6.74,12.45 4.2,12.45 2.42,14.22 2.42,15.11 v1.28,16.26 | U$48.P$12 4.17,19.53 C36.2 | U$48.P$4 9.74,24.26 | 9.74,24.26 9.74,24.81 C37.2 9.91,25.53 8.01,27.43 | MCU.14 35.38,96.33 | 35.38,96.33 C9.1 | 35.38,96.33 35.88,95.83 MCU.13 35.88,90.23 35.94,90.17 39.25,90.17 | MCU.48 41.88,81.75 C4.2 41.8,81.66 | C8.2 40.88,96.43 MCU.3 40.88,94.38 41.03,94.23 41.03,93.73 39.25,91.95 39.25,90.17 | C22.1 56.47,102.81 U6.4 56.17,102.26 55.51,101.6 53.98,101.6 | 53.98,101.6 51.76,101.6 R50.1 R51.1 | IC3.4 52.74,54 | 52.74,54 C16.2 | C20.2 43.36,63.71 IC4.4 43.36,60.76 42.55,59.94 39.38,59.94 37.6,58.17 37.6,55.37 v36.97,54.74 | MCU.48 41.88,85.02 41.87,85.02 40.27,86.61 40.27,86.62 | 39.25,90.17 40.39,89.03 40.39,87.63 40.4,86.62 40.27,86.62 | U$48.P$3 10.24,23.76 9.74,24.26 | 8.01,27.43 6.99,28.45 6.99,35.69 8.9,37.59 8.9,40.89 10.04,42.04 10.04,47.12 | 10.04,47.12 10.04,49.46 U$9.P$3 | U$5.P$3 19.92,48.23 19.82,48.13 | 19.82,48.13 19.31,47.62 v15.38,47.62 | v13.72,47.37 10.29,47.37 10.04,47.12 | 19.82,48.13 19.82,47.88 v19.95,47.75 | 53.98,101.6 54.11,101.47 54.11,91.69 45.47,83.06 41.92,83.06 41.92,83.64 MCU.48 | U$3.P$1 14.49,95.25 13.47,94.23 13.47,77.09 14.36,76.2 16.26,76.2 16.9,76.83 v16.9,78.49 | v19.44,78.23 19.44,78.49 R30.2 R1.2 25.61,78.81 v26.8,80.01 26.8,82.3 29.98,85.47 29.98,86.24 C7.1 30.37,86.62 MCU.30 40.27,86.62 | 8.01,27.43 8.01,27.3 7.12,26.42 7.12,24.64 v6.36,23.88 | v3.44,20.32 3.44,20 C36.2 | v2.93,17.91 2.93,18.43 C36.2 | 19.44,57.78 IC2.4 17.19,61.25 v16.52,60.58
  Top 0.254: 19.44,57.78 IC2.2 | v12.07,53.34 12.07,52.83 C12.+ 13.34,53.47 13.34,54.99 14.23,55.88 C3.1 16.9,57.78 19.44,57.78 | 52.74,54 50.45,54 v50.43,53.98 | v49.03,52.7 45.47,52.7 v45.09,52.32 43.06,52.32 v41.92,51.18 | v34.68,51.05 33.23,51.05 U$6.P$3 | v11.31,63.5 11.31,65.66 19.57,73.91 v19.57,76.83
  Bottom 0.254: v26.8,80.01 26.88,79.94 SWD1.1 26.8,78.21 | v15.38,47.62 13.98,47.62 v13.72,47.37 | v19.95,47.75 19.95,48.26 | v16.9,78.49 19.18,78.49 v19.44,78.23 19.57,78.11 v19.57,76.83 | v6.36,23.88 6.23,23.88 3.44,21.08 v3.44,20.32 | v1.28,16.26 v2.93,17.91 | v12.07,53.34 11.82,53.09 11.82,52.2 9.62,50 U$9.P$3 | U$5.P$3 27.4,48.47 28.96,50.04 30.88,50.04 U$6.P$3 | v50.43,53.98 50.3,53.98 v49.03,52.7 | v45.09,52.32 45.09,49.97 U$13.P$3 | v41.92,51.18 41.79,51.18 40.9,50.29 35.44,50.29 v34.68,51.05 34.68,53.47 35.95,54.74 v36.97,54.74 | v16.52,60.58 v11.31,63.5
3.3VAUDIO1
  Top 0.203: U$48.P$24 14.23,19.53 C43.1 C44.1 14.22,18.14 L3.2
12V  (via drill 0.3)
  Top 0.381: IC1.4 30.41,11.76 C23.2 29.6,11.81 v29.47,11.81 | v29.98,14.48 29.98,16.51 32.59,19.12 C38.2 36.88,18.43 IC5.4 40.28,18.43 41.03,19.18 41.03,40.89 40.27,41.66 40.27,51.31 v40.14,51.44 | C13.+ 21.41,51.37 C11.2 21.41,54.62 IC2.3 | IC2.3 22.23,55.45 22.23,63.12 24.02,64.91 D12.2 | v37.6,51.56 36.97,51.56 34.17,54.36 22.34,54.36 IC2.3
  Bottom 0.381: v29.98,14.48 29.98,12.32 v29.47,11.81 | v40.14,51.44 37.73,51.44 v37.6,51.56
-12V  (via drill 0.3)
  Top 0.381: C24.1 30.41,3.21 IC1.11 30.41,6.05 v30.36,6.1 | v30.36,7.62 34.68,7.62 35.31,8.26 35.31,10.29 35.95,10.92 40.77,10.92 42.68,12.83 47.89,12.83 49.22,14.16 49.16,15.75 v49.16,16.13 | v47.76,17.53 46.36,18.92 C39.1 45.23,18.43 IC5.11 42.41,18.43 41.79,19.05 41.79,41.27 41.03,42.04 41.03,52.2 v40.65,52.58 | D13.1 29.45,68.83 C5.- 31.82,68.64 R26.1 31.88,66.89 31.88,65.41 32.9,64.39 32.9,62.23 31.76,61.09 31.76,57.66 33.92,55.5 34.93,55.5 37.22,53.21 v37.73,53.21
  Bottom 0.381: v30.36,6.1 v30.36,7.62 | v47.76,17.53 v49.16,16.13 | v40.65,52.58 38.36,52.58 v37.73,53.21
ADC_A  (via drill 0.3)
  Top 0.203: R14.1 C17.2 56.55,54.25 IC3.7 56.58,56.9 57.67,56.9 58.55,57.78 58.55,81.41 56.78,83.19 56.78,90.04 56.14,90.68 v54.24,90.68 | MCU.53 46.48,87.62 v46.36,87.63 | v47.38,86.11 47.76,86.11 51.7,90.04 v51.7,90.42
  Bottom 0.203: v46.36,87.63 46.36,87.12 v47.38,86.11 | v51.7,90.42 53.98,90.42 v54.24,90.68
ADC_B  (via drill 0.3)
  Top 0.203: IC4.7 39.55,64.33 C18.2 39.43,65.53 | 39.43,65.53 R18.1 39.51,66.13 v39.51,68.2 | v47.76,87.76 47.39,88.12 47.14,88.12 47,88.27 45.98,88.27 45.85,88.14 43.84,88.14 MCU.54 | v49.28,84.45 49.03,84.58 48.27,84.58 45.22,81.53 45.22,79.76 45.6,79.38 45.6,78.74 44.71,77.85 44.71,74.93 v39.76,69.98 | 39.38,65.58 39.43,65.53
  Bottom 0.203: v47.76,87.76 49.28,86.23 v49.28,84.45 | v39.76,69.98 39.76,68.45 v39.51,68.2
ADC_C  (via drill 0.3)
  Top 0.203: IC4.1 47.17,64.27 C19.2 R22.1 49.01,68.07 56.78,68.07 57.16,68.45 57.16,79.88 56.02,81.03 v52.59,81.03 | 48.16,88.62 v48.4,88.39 48.14,88.65 47.38,88.65 47.25,88.77 45.73,88.77 45.58,88.62 MCU.55
  Bottom 0.203: v48.4,88.39 49.41,88.39 50.55,87.25 50.55,83.06 v52.59,81.03
ADC_D  (via drill 0.3)
  Top 0.203: IC3.8 56.55,64.79 R10.1 C15.2 56.86,66.51 58.05,67.69 58.05,80.77 56.78,82.04 55,82.04 v54.87,81.92 | 49,89.12 v49.16,89.28 49.03,89.15 47.76,89.15 47.63,89.28 45.47,89.28 45.32,89.12 MCU.56
  Bottom 0.203: v54.87,81.92 52.33,81.92 50.94,83.31 50.94,87.5 v49.16,89.28
ADC_PITCH  (via drill 0.3)
  Top 0.203: IC4.14 47.17,54.11 R65.1 48.78,53.98 53.35,49.4 57.79,49.4 59.06,50.67 59.06,90.81 57.79,92.08 v54.74,92.08 | MCU.62 45.78,92.12 v45.98,92.33
  Bottom 0.203: v45.98,92.33 45.98,91.82 47.38,90.42 49.79,90.42 51.44,92.08 v54.74,92.08
AGND
  Top 0.381: R74.1 40.2,6.3 U$37.RING@3
AGND2
  Top 0.381: R75.1 19.79,6.27 U$2.SWITCH@3 U$2.RING@3 U$27.SWITCH@3 U$27.RING@3
AGND3
  Top 0.381: U$36.RING@3 50.41,4.94 46.49,1.02 40.52,1.02 R76.1
CODEC_DIN
  Top 0.203: U$48.P$10 5.39,20.53 3.82,22.1 3.82,48.77 13.6,58.55 13.6,64.52 22.23,73.15 32.27,73.15 32.9,73.79 38.62,73.79 39.88,75.05 MCU.44
CODEC_DOUT  (via drill 0.3)
  Top 0.203: U$48.P$8 5.91,21.53 4.83,22.61 4.83,48.77 14.36,58.29 14.36,63.75 21.6,70.99 v30.23,70.99 | v32.01,70.99 39.89,70.99 44.08,75.18 v44.08,82.3 | v45.35,86.36 45.11,86.12 MCU.50
  Bottom 0.203: v30.23,70.99 v32.01,70.99 | v44.08,82.3 44.08,82.93 43.7,83.31 43.7,84.71 v45.35,86.36
CODEC_LRCLK  (via drill 0.3)
  Top 0.203: U$48.P$7 6.48,22.61 5.34,23.75 5.47,48.9 14.74,58.17 14.74,63.5 21.6,70.36 30.49,70.36 32.65,72.52 38.11,72.52 39.76,74.17 v40.01,74.17 | MCU.42 38.88,76.21 v38.62,75.95
  Bottom 0.203: v38.62,75.95 38.62,75.56 v40.01,74.17
CODEC_MCLK  (via drill 0.3)
  Top 0.203: U$48.P$11 5.25,20.03 3.31,21.97 3.31,48.77 13.22,58.67 13.22,64.77 22.23,73.79 v31.88,73.79 | v34.68,71.88 39.89,71.88 43.57,75.56 43.57,80.26 v43.06,80.77 | MCU.51 42.92,86.62 v42.68,86.87
  Bottom 0.203: v31.88,73.79 32.77,73.79 v34.68,71.88 | v42.68,86.87 42.68,81.15 v43.06,80.77
CODEC_RESET  (via drill 0.3)
  Top 0.203: U$48.P$15 7.29,17.44 v6.74,16.89 | v5.09,16.64 3.06,16.64 2.29,17.4 2.29,48.26 12.84,58.8 12.84,64.9 22.36,74.42 28.46,74.42 28.58,74.42 38.49,74.42 39.38,75.31 MCU.43
  Bottom 0.203: v6.74,16.89 5.34,16.89 v5.09,16.64
CODEC_SCL  (via drill 0.3)
  Top 0.203: U$48.P$16 8.74,16.18 R55.1 7.05,15.31 v6.49,15.88 | v4.58,15.88 3.06,15.88 1.91,17.02 1.91,48.39 12.45,58.93 12.45,65.28 22.23,75.06 v34.55,75.06 | v35.82,76.71 36.38,77.27 MCU.37
  Bottom 0.203: v6.49,15.88 v4.58,15.88 | v34.55,75.06 35.82,76.33 v35.82,76.71
CODEC_SCLK  (via drill 0.3)
  Top 0.203: U$48.P$9 5.65,21.03 4.33,22.35 4.33,48.77 13.98,58.42 13.98,64.01 22.49,72.52 32.14,72.52 32.77,73.15 v35.7,73.15 | MCU.41 38.38,76.6 36.84,75.06 v36.46,75.06
  Bottom 0.203: v35.7,73.15 35.7,74.3 v36.46,75.06
CODEC_SDA  (via drill 0.3)
  Top 0.203: U$48.P$17 R54.1 9.24,15.2 v8.77,14.73 | v3.31,15.11 1.53,16.89 1.53,48.51 12.07,59.05 12.07,65.66 22.23,75.82 35.95,75.82 36.88,76.75 MCU.38
  Bottom 0.203: v8.77,14.73 3.69,14.73 v3.31,15.11
DOWNBUTTON
  Top 0.203: MCU.60 47.44,91.12 U$38.1 51.44,95.12 51.44,97.92 U$38.2
ENTERBUTTON  (via drill 0.3)
  Top 0.203: U$39.2 54.24,87.63 54.24,85.09 U$39.1 50.55,86.23 49.28,86.23 44.71,81.66 v44.71,78.99 | MCU.46 40.88,79.52 41.41,78.99 v42.93,78.99
  Bottom 0.203: v42.93,78.99 v44.71,78.99
ENVELOPE_OUT
  Top 0.203: R52.1 53.23,22.67 U$34.TIP@3
ENVELOPE_OUT_PREAMP
  Top 0.203: MCU.18 28.62,92.62 23.88,87.88 23.88,85.6 20.45,82.17 19.21,82.17 R48.2
GATE_TRIGGER  (via drill 0.3)
  Top 0.203: Q2.C 8.86,100.12 12.71,96.27 12.71,77.22 14.36,75.56 v16.64,75.56 | 18.42,76.96 18.42,78.99 R30.1 19.76,80.2 | MCU.35 35.38,79.57 33.41,77.6 19.06,77.6 18.42,76.96 | v18.17,76.58 18.17,76.71 18.42,76.96
  Bottom 0.203: v16.64,75.56 17.15,75.56 v18.17,76.58
GND  (via drill 0.3)
  Top 0.203: U$48.P$20 10.74,19.03 U$48.PAD | U$48.P$25 U$48.PAD | U$48.P$5 9.24,20.53 | 9.24,20.53 U$48.PAD | U$48.PAD 8.74,19.03 U$48.P$13 5.05,19.03 C36.1 3.97,17.43 v3.82,17.27 | U$48.P$18 U$48.PAD | U$48.P$19 10.24,19.53 U$48.PAD | U$48.P$2 10.74,20.51 10.93,20.32 10.04,20.32 U$48.PAD | U$48.P$1 11.24,21.53 U$48.PAD | 9.24,20.53 8.74,21.03 U$48.P$6 8.74,24.61 C37.1 v8.38,25.65 v8.39,25.65 | C35.1 11.23,13.76 v11.31,13.84 | C42.1 4.49,13.3 v4.45,13.34 | C45.2 16.25,21.86 v16.14,21.97 | C43.2 15.8,20.03 v15.76,20.07 | C44.2 16.75,18.65 v16.77,18.67 | MCU.4 40.38,94.12 v40.27,93.98 | C8.1 v41.41,99.19 | C21.1 v37.6,99.19 | C9.2 v34.42,99.44 | MCU.16 34.38,94.32 v34.3,94.23 | MCU.15 34.88,93.91 v34.93,93.85 | Q2.E 6.66,101.77 v6.61,101.73 | MCU.31 33.43,86.12 v33.79,85.85 | MCU.47 41.38,84.42 v40.9,84.96 | C4.1 42.49,80.07 v42.55,80.01 | U6.2 54.94,103.44 v55.38,103.89 55.88,104.38 U6.5 57.93,104.38 C22.2 | IC5.5 36.98,17.16 v36.97,17.14 36.52,17.59 C38.1 | C39.2 45.09,17.4 v44.97,17.27 44.85,17.16 IC5.10 | IC1.10 29.14,3.51 v29.34,3.3 29.48,3.17 C24.2 | IC1.12 31.68,6.02 v31.76,6.1 | R76.2 v36.33,4.32 | R74.2 36.3,5.74 v36.33,5.71 | IC1.3 31.68,11.25 v31.63,11.3 31.5,11.43 C23.1 | IC1.5 29.14,8.56 v29.34,8.51 | R75.2 25.46,6.27 v25.54,6.35 | IC5.3 39.62,19.7 v39.63,19.68 | IC3.5 54.01,55.53 v53.98,55.5 | IC3.10 53.37,62.12 v53.35,62.1 53.33,62.12 IC3.11 | C16.1 52.8,51.73 v52.84,51.69 | IC4.3 44.63,60.63 v44.59,60.58 | IC4.5 42.09,60.63 v42.05,60.58 | IC4.12 v44.09,56.78 v44.08,56.77 44.06,56.78 IC4.11 | C20.1 v42.42,66.8 v42.43,66.8 | C1.2 30.47,78.59 v30.49,78.61 30.51,78.59 C2.2 | C7.2 28.52,86.8 v28.71,87 | L1.2 26.61,96.2 v26.68,96.27
  Top 0.203: v14.11,52.45 14.87,52.45 C12.- 14.93,54.29 C3.2 15.25,54.36 v15.88,54.99 15.92,54.95 IC2.1 | C13.- v18.3,51.18 | C11.1 19.82,52.96 v19.31,52.96 | C5.+ v35.31,68.83 | U2.1 35.31,63.5 v34.81,63.5 | C6.1 35.92,61.59 v35.31,61.59
  Bottom 0.203: v11.31,13.84 11.44,13.84 | v4.45,13.34 4.45,13.46 | v3.82,17.27 3.82,17.65 | v16.14,21.97 16.01,21.97 | v15.76,20.07 15.63,20.07 | v16.77,18.67 16.9,18.67 | v41.41,99.19 41.41,99.44 | v37.6,99.19 37.6,99.44 | v34.42,99.44 34.42,99.82 | v34.3,94.23 34.3,93.85 | v34.93,93.85 34.93,93.73 | v6.61,101.73 6.61,101.6 6.74,101.47 | v40.9,84.96 41.03,85.09 | v42.55,80.01 42.68,80.01 | v55.38,103.89 55.25,103.76 | v36.97,17.14 36.97,17.27 36.84,17.4 | v44.97,17.27 44.97,17.14 44.84,17.02 | v29.34,3.3 29.6,3.3 | v31.76,6.1 31.76,6.22 | v36.33,4.32 36.33,4.57 | v36.33,5.71 36.33,5.46 | v31.63,11.3 31.5,11.3 | v29.34,8.51 29.09,8.38 | v25.54,6.35 25.66,6.35 25.79,6.48 | v39.63,19.68 39.89,19.68 | v53.98,55.5 53.98,55.24 | v53.35,62.1 53.35,61.85 | v52.84,51.69 52.84,51.44 | v44.59,60.58 44.59,60.45 44.71,60.33 | v42.05,60.58 42.05,60.33 | v44.08,56.77 44.08,56.64 | v42.43,66.8 42.55,66.8 42.68,66.93 | v30.49,78.61 30.49,78.74 30.36,78.87 | v28.71,87 28.84,87.12 | v8.39,25.65 8.39,26.04 | v26.68,96.27 26.93,96.27 | v14.11,52.45 13.98,52.45 | v18.3,51.18 18.17,51.31 18.04,51.31 | v19.31,52.96 19.06,52.96 | v35.31,68.83 35.57,68.83 | v34.81,63.5 34.42,63.5 | v35.31,61.59 34.93,61.59 | v15.88,54.99 16.01,54.99 16.14,54.86
  other vias: 9.15,20.57 10.29,20.57 10.29,19.43 9.15,19.43
  pour Bottom: -0.5,106.68 60.46,106.68 60.46,0 -0.5,0
INPUT_L
  Top 0.203: IC1.7 26.6,11.76 26.42,11.94 25.03,11.94 R3.1 24.9,13.84 24.16,14.59 C31.-
INPUT_R
  Top 0.203: IC1.1 34.22,11.86 | 34.22,11.86 R63.1 | 34.22,11.86 34.22,12.9 33.41,13.72 25.92,13.72 23.05,16.59 C32.-
JTAG_TDI  (via drill 0.3)
  Top 0.203: MCU.23 30.06,90.12 v29.73,89.79 | v27.44,90.17 24.52,87.25 24.52,85.22 v23.25,83.95
  Bottom 0.203: v29.73,89.79 27.82,89.79 v27.44,90.17 | v23.25,83.95 23.25,82.27 SWD1.8
KNOB_A
  Top 0.203: U$6.P$2 31.73,53.47 33.54,53.47 36.11,50.89 R16.2
KNOB_B
  Top 0.203: R20.2 19.44,45.09 17.66,46.86 15.22,46.86 U$9.P$2
KNOB_C
  Top 0.203: R24.2 34.39,43.81 U$5.P$2
KNOB_D
  Top 0.203: R12.2 55.13,44.96 53.35,46.74 50.9,46.74 U$13.P$2
LED_DOWN  (via drill 0.3)
  Top 0.203: MCU.64 47.85,93.12 v48.01,92.96 | v48.78,91.57 49.44,91.57 R44.2
  Bottom 0.203: v48.01,92.96 48.01,92.33 v48.78,91.57
LED_ENTER  (via drill 0.3)
  Top 0.203: MCU.49 45.96,85.62 v46.36,85.22 | v48.27,83.31 48.27,83.25 R45.2
  Bottom 0.203: v46.36,85.22 v48.27,83.31
LED_UP  (via drill 0.3)
  Top 0.203: v47.25,82.3 48.52,81.03 48.52,72.52 49.66,71.37 R4.2 | v41.16,87.5 41.16,86.61 42.55,85.22 42.55,84.2 42.93,83.82 v44.84,83.82 | MCU.29 39.38,87.12 v39.76,87.5
  Bottom 0.203: v47.25,82.3 45.73,83.82 v44.84,83.82 | v39.76,87.5 v41.16,87.5
LEFT_AFTER_CAP  (via drill 0.3)
  Top 0.203: C29.- 20.71,21.59 20.45,21.34 20.45,18.54 19.82,17.91 19.82,11.56 v21.85,9.53 | v21.85,5.21 24.9,5.21 25.41,4.7 25.41,2.03 25.92,1.52 26.5,1.52 26.52,1.5 R59.2
  Bottom 0.203: v21.85,9.53 v21.85,5.21
LEFT_BEFORE_CAP
  Top 0.203: U$48.P$28 13.15,21.53 14.36,22.73 18.27,22.73 C29.+
LEFT_POST_OPAMP
  Top 0.203: R58.1 26.6,2.62 IC1.8 26.6,6.27 27.19,6.86 35.31,6.86 36.46,8 36.46,9.31 R56.2
LEFT_PRE_OPAMP
  Top 0.203: IC1.9 27.87,2.71 R58.2 R59.1
LEFT_TO_JACK
  Top 0.203: R56.1 42.5,9.4 U$37.TIP@3
N$1
  Top 0.203: R2.2 21.6,8.64 19.44,10.79 16.07,10.79 U$2.TIP@3
N$2
  Top 0.203: IC1.6 27.87,8.56 27.44,8.13 25.28,8.13 R2.1 24.77,10.41 R3.2
N$3
  Top 0.203: U$26.TIP@3 19.06,30.48 R17.2
N$4  (via drill 0.3)
  Top 0.203: R19.1 40.95,67.97 R18.2 C18.1 40.82,64.33 IC4.6 40.82,61.01 40.27,60.45 36.2,60.45 36.08,60.58 33.03,60.58 v32.65,60.2 | R17.1 19.31,42.04 R20.1 23.5,46.23 v23.5,47.37 | v31,59.31 26.8,55.12 v26.42,55.12 | v26.42,53.59 23.63,50.8 v23.5,50.8
  Bottom 0.203: v32.65,60.2 31.88,60.2 v31,59.31 | v26.42,55.12 v26.42,53.59 | v23.5,50.8 v23.5,47.37
N$5
  Top 0.203: U$24.TIP@3 35.31,28.83 R21.2
N$6
  Top 0.203: R4.1 53.22,73.12 U$4.LEDPOS
N$7  (via drill 0.3)
  Top 0.203: R21.1 36.84,41.91 R24.1 37.6,42.29 38.36,43.05 38.36,57.91 39.76,59.31 v43.31,59.31 | 46.24,68.1 R23.1 45.46,67.33 R22.2 C19.1 45.9,64.02 IC4.2 45.9,60.12 v45.09,59.31
  Bottom 0.203: v45.09,59.31 v43.31,59.31
N$11
  Top 0.203: Q2.B R29.2
N$13  (via drill 0.3)
  Top 0.381: D12.1 18.07,63.12 v16.14,63.12
  Bottom 0.381: U$35.10 15.76,62.42 | 15.76,62.42 U$35.9 | v16.14,63.12 15.76,62.74 15.76,62.42
N$15
  Top 0.203: U$29.TIP@3 54.49,30.48 R9.2
N$16  (via drill 0.3)
  Top 0.203: C15.1 R10.2 55.28,64.54 IC3.9 55.28,60.3 57.54,58.04 v57.54,57.66 | R9.1 55.13,32.38 R12.1 55.51,42.8 58.05,45.34 v58.05,48.64 57.98,48.58 | R11.1 v58.01,53.71 58.01,56.35 v58.3,56.64
  Bottom 0.203: v58.3,56.64 58.3,56.9 v57.54,57.66 | v58.01,53.71 58.01,54.14 58.05,52.83 v58.05,48.64
N$17
  Top 0.203: U$25.TIP@3 5.85,56.39 R13.2
N$18  (via drill 0.3)
  Top 0.203: IC3.6 55.28,54.51 C17.1 R14.2 | R14.2 R15.1 | R13.1 6.61,55.63 v7.37,55.63 | v10.42,52.45 11.44,51.44 16.77,51.44 18.17,50.04 34.55,50.04 35.27,49.32 R16.1 36.19,49.4 37.6,49.4 v37.6,49.28 | v42.05,49.66 44.08,51.69 49.66,51.69 v49.92,51.94 | v54.36,53.09 54.36,53.07 R14.2
  Bottom 0.203: v7.37,55.63 10.42,52.58 v10.42,52.45 | v37.6,49.28 41.66,49.28 v42.05,49.66 | v49.92,51.94 50.94,52.96 54.24,52.96 v54.36,53.09
N$19
  Top 0.203: U$32.TIP@3 5.85,93.98 2.8,97.03 2.8,104.39 R29.1
N$20
  Top 0.203: MCU.7 38.88,96 38.74,96.14 38.42,96.14 C21.2
N$21
  Top 0.203: JP1.D+ 21.03,90.23 22.23,91.44 24.39,91.44 34.17,101.22 38.87,101.22 40.14,99.95 R31.2
N$22
  Top 0.203: R32.2 38.87,100.08 38.23,100.71 34.42,100.71 24.52,90.81 23.54,90.81 JP1.D-
N$23  (via drill 0.3)
  Top 0.254: JP1.VBUS 24.66,92.72 v25.66,93.73 | v28.71,93.73 33.66,93.73 v34.55,92.84 | v36.58,92.84 37.6,92.84 38.38,93.62 MCU.8
  Bottom 0.254: v25.66,93.73 v28.71,93.73 | v34.55,92.84 v36.58,92.84
N$24
  Top 0.203: MCU.5 39.88,96.7 R31.1
N$25
  Top 0.203: MCU.6 39.38,96.45 R32.1
N$26
  Top 0.381: JP1.GND 20.56,92.72 L1.1
N$38
  Top 0.203: R44.1 51.1,92.08 U$38.LEDPOS
N$39
  Top 0.203: R45.1 53.68,81.83 U$39.LEDPOS
N$47
  Top 0.203: IC5.8 45.42,14.62 R46.1 C40.2 47.76,14.35 48.4,14.99 48.4,18.67 45.98,21.08 45.98,22.61 R52.2
N$52  (via drill 0.3)
  Top 0.203: C32.+ 16.82,16.59 v16.01,17.4 | v13.47,18.16 13.47,18.8 13.24,19.03 U$48.P$23
  Bottom 0.203: v16.01,17.4 14.23,17.4 v13.47,18.16
N$54  (via drill 0.3)
  Top 0.203: IC5.6 36.45,15.89 C41.1 R49.2 33.28,17.53 v33.28,18.29 | R48.1 17.59,72.83 14.11,69.34 11.95,69.34 1.91,59.31 1.91,52.45 v2.55,51.82 | v18.68,34.92 18.42,35.18 18.42,36.7 11.06,44.07 v11.06,46.1 | v20.2,34.67 20.33,34.67 22.11,32.89 22.11,26.04 26.93,21.21 31.76,21.21 v33.16,19.81 | v7.25,47.12 8.52,47.12 v9.41,46.23
  Bottom 0.203: v18.68,34.92 19.95,34.92 v20.2,34.67 | v33.16,19.81 33.16,18.41 v33.28,18.29 | v2.55,51.82 v7.25,47.12 | v9.41,46.23 10.93,46.23 v11.06,46.1
N$55
  Top 0.203: C41.2 38.29,14.61 IC5.7 | C41.2 R49.1 | C41.2 36.2,12.59 R47.2
N$56
  Top 0.203: C40.1 R46.2 45.67,15.89 IC5.9 42.31,15.89 41.54,15.11 41.54,12.95 40.94,12.36 R47.1
N$57  (via drill 0.3)
  Top 0.203: MCU.26 33.13,88.62 v33.54,89.03
  Bottom 0.203: TP1.P$1 33.41,88.9 v33.54,89.03
N$61  (via drill 0.3)
  Top 0.203: U$48.P$27 13.54,21.03 v13.72,21.21 | v17.66,19.94 19.05,19.94 C30.+
  Bottom 0.203: v13.72,21.21 16.01,21.21 17.28,19.94 v17.66,19.94
N$63  (via drill 0.3)
  Top 0.203: U$48.P$22 12.33,16.26 v12.45,16.13 | v15.5,16 17.46,16 C31.+
  Bottom 0.203: v12.45,16.13 15.38,16.13 v15.5,16
N$64  (via drill 0.3)
  Top 0.381: v22.49,69.47 23.46,68.5 D13.2
  Bottom 0.381: U$35.2 U$35.1 24.11,69.47 v22.49,69.47
N$70
  Top 0.203: U$27.TIP@3 5.14,11.56 4.33,11.56 1.21,14.67 R64.2
N$71
  Top 0.203: IC5.2 36.34,20.97 R71.2 R70.1
N$72
  Top 0.203: IC5.1 36.32,22.24 R71.1 36.2,24.64 39.51,27.94 39.51,53.21 40.28,53.98 R62.2
N$73  (via drill 0.3)
  Top 0.203: v23.38,4.32 23.38,1.52 24.39,0.51 30.12,0.51 R61.2 | C30.- 21.51,19.59 20.96,19.05 20.96,18.29 20.33,17.65 20.33,12.95 v23.25,10.03
  Bottom 0.203: v23.25,10.03 23.38,9.91 v23.38,4.32
N$75
  Top 0.203: IC1.14 34.22,2.88 R60.1 34.96,1.64 R57.2
N$76
  Top 0.203: IC1.13 32.95,3.14 R60.2 32.44,1.31 R61.1
N$78  (via drill 0.3)
  Top 0.203: R57.1 38.47,1.64 v38.49,1.65 | v40.14,3.17 40.52,3.17 46.74,9.4 52.66,9.4 U$36.TIP@3
  Bottom 0.203: v38.49,1.65 38.62,1.65 v40.14,3.17
N$83
  Top 0.203: IC1.2 32.95,12.12 | 32.95,12.12 R63.2 | 32.95,12.12 32.95,12.78 32.52,13.21 29.34,13.21 28.46,12.32 28.46,8.38 27.69,7.62 21.73,7.62 19.82,9.53 18.17,9.53 17.79,9.14 2.8,9.14 1.28,10.67 1.28,12.05 R64.1
N$84
  Top 0.203: R62.1 R65.2 45.9,54.11 IC4.13 45.85,56.83 45.85,57.53 43.95,59.44 43.95,63.25 43.92,63.27 R73.1
N$87
  Top 0.203: U$48.P$14 6.21,18.53 5.85,18.16 5.85,14.01 C42.2
N$88
  Top 0.203: U$48.P$26 13.85,20.53 C45.1
OLED_CLK  (via drill 0.3)
  Top 0.203: U$3.P$5 15.25,85.09 16.9,86.74 16.9,99.44 18.42,100.97 19.69,100.97 23,104.27 38.74,104.27 41.79,101.22 v41.92,101.22 | MCU.58 42.6,90.12 41.28,91.44 41.28,92.46 43.95,95.12 44.33,95.12 44.97,95.76 44.97,96.52 v44.33,97.16
  Bottom 0.203: v44.33,97.16 44.2,97.16 42.68,98.68 42.68,100.46 v41.92,101.22
OLED_CS  (via drill 0.3)
  Top 0.203: U$3.P$6 15.38,82.55 17.53,84.71 17.53,99.31 18.55,100.33 19.82,100.33 23.12,103.63 38.62,103.63 v42.05,100.2 | MCU.57 42.34,89.62 40.65,91.31 40.65,92.46 43.76,95.57 v44.2,96.01
  Bottom 0.203: v42.05,100.2 42.05,98.17 v44.2,96.01
OLED_DAT  (via drill 0.3)
  Top 0.203: U$3.P$4 15.25,87.63 16.39,88.77 16.39,99.69 18.17,101.47 19.57,101.47 22.87,104.78 40.01,104.78 v42.3,102.49 | MCU.59 42.86,90.62 41.92,91.57 41.92,92.46 43.95,94.49 44.59,94.49 45.85,95.76 45.85,96.77 v45.6,97.03
  Bottom 0.203: v42.3,102.49 43.19,101.6 43.19,99.44 v45.6,97.03
OLED_DC  (via drill 0.3)
  Top 0.203: v49.79,92.46 50.3,91.95 50.3,89.28 48.01,87 45.98,87 45.85,87.12 MCU.52 | v48.27,96.27 48.27,100.58 46.36,102.49 v45.73,102.49 | v43.06,104.01 41.66,105.41 16.52,105.41 11.18,100.08 11.18,98.93 v11.06,98.81 | v11.18,96.9 11.95,96.14 11.95,80.26 v12.07,80.14
  Bottom 0.203: v49.79,92.46 49.79,92.58 48.65,93.73 48.65,95.89 v48.27,96.27 | v45.73,102.49 44.59,102.49 v43.06,104.01 | v11.06,98.81 11.06,97.03 v11.18,96.9 | v12.07,80.14 14.61,80.14 U$3.P$7
OLED_RESET  (via drill 0.3)
  Top 0.203: MCU.61 46.55,91.62 v47.12,92.2 | v47.51,94.11 47.51,94.36 49.03,95.89 49.03,100.97 v47.12,102.87 | v44.71,105.28 43.95,106.05 16.26,106.05 v10.17,99.95 | v9.03,98.81 9.03,98.04 11.18,95.89 11.18,78.23 v11.95,77.47
  Bottom 0.203: v47.12,92.2 47.12,93.73 v47.51,94.11 | v47.12,102.87 v44.71,105.28 | v10.17,99.95 v9.03,98.81 | v11.95,77.47 U$3.P$8
PITCH  (via drill 0.3)
  Top 0.203: U$22.TIP@3 5.85,72.14 0.64,66.93 0.64,52.58 2.04,51.18 v2.04,50.55 | R70.2 27.06,22.35 23,26.42 23,33.4 v20.33,36.07 | v6.36,45.85 7.88,45.85 v8.26,45.47 | v10.93,43.05 10.93,42.93 v17.53,36.32
  Bottom 0.203: v20.33,36.07 17.79,36.07 v17.53,36.32 | v2.04,50.55 2.04,50.16 v6.36,45.85 | v8.26,45.47 8.52,45.47 v10.93,43.05
REF_-5V  (via drill 0.3)
  Top 0.203: R19.2 43.7,68.01 | 43.7,68.01 R23.2 45.7,69.09 47,69.09 47.63,68.45 v47.63,67.94 | R73.2 43.92,67.78 43.7,68.01 | 42.55,68.05 R19.2 | R26.2 33.44,67.06 36.46,67.06 37.28,67.88 | 37.28,67.88 38.49,69.09 41.54,69.09 42.51,68.11 R19.2 | 37.28,67.88 37.28,63.84 U2.2 37.48,63.64 C6.2 | R11.2 57.46,50.95 R15.2 56.42,50.57 55.76,49.91 53.6,49.91 48.14,55.37 48.14,66.29 v48.4,66.55
  Bottom 0.203: v48.4,66.55 48.4,67.18 v47.63,67.94
RESET  (via drill 0.3)
  Top 0.203: v31.25,87.63 28.2,87.63 27.19,86.61 27.19,85.72 27.82,85.09 27.82,84.07 24.08,80.33 R1.1 21.04,81.22 v21.09,81.28 | MCU.34 34.88,85.8 v34.93,85.85
  Bottom 0.203: v31.25,87.63 34.68,87.63 34.93,87.38 v34.93,85.85 | v21.09,81.28 21.09,81.39 SWD1.10
SCL
  Top 0.203: U6.1 52,104.38 R50.2 51.25,103.82 50.17,104.9 45.6,104.9 43.06,102.36 43.06,97.16 42.05,96.14 41.54,96.14 41.41,96.01 41.41,95.1 MCU.2
SDA
  Top 0.203: U6.3 52.45,102.5 52.08,102.87 50.49,102.87 R51.2 45.73,103.63 43.7,101.6 43.7,96.65 42.12,95.07 MCU.1
SWCLK  (via drill 0.3)
  Top 0.203: MCU.22 29.55,90.62 25.79,86.87 v25.79,84.33
  Bottom 0.203: v25.79,84.33 25.79,82.27 SWD1.4
SWDIO  (via drill 0.3)
  Top 0.203: v26.93,84.45 26.42,84.96 26.42,86.74 28.81,89.12 MCU.25
  Bottom 0.203: SWD1.2 26.88,84.4 v26.93,84.45
SWO  (via drill 0.3)
  Top 0.203: MCU.24 33.37,89.62 v33.66,89.92 | v29.98,91.31 29.47,91.31 25.15,87 25.15,84.84 v24.39,84.07
  Bottom 0.203: v33.66,89.92 31.38,89.92 v29.98,91.31 | v24.39,84.07 24.39,82.15 SWD1.6
UPBUTTON  (via drill 0.3)
  Top 0.203: U$4.1 51.57,74.93 51.57,77.47 U$4.2 | MCU.45 40.38,78.88 v41.66,77.6 | v45.47,77.6 46.62,77.6 v47.76,78.74
  Bottom 0.203: v41.66,77.6 v45.47,77.6 | v47.76,78.74 U$4.2
XTAL1
  Top 0.203: MCU.32 28.34,81.53 X1.2 28.11,80.87 C1.1
XTAL2
  Top 0.203: C2.1 32.76,80.99 X1.1 32.65,82.42 33.9,83.67 MCU.33